# Altium project S3800.PrjPCB (part 1 of 3)
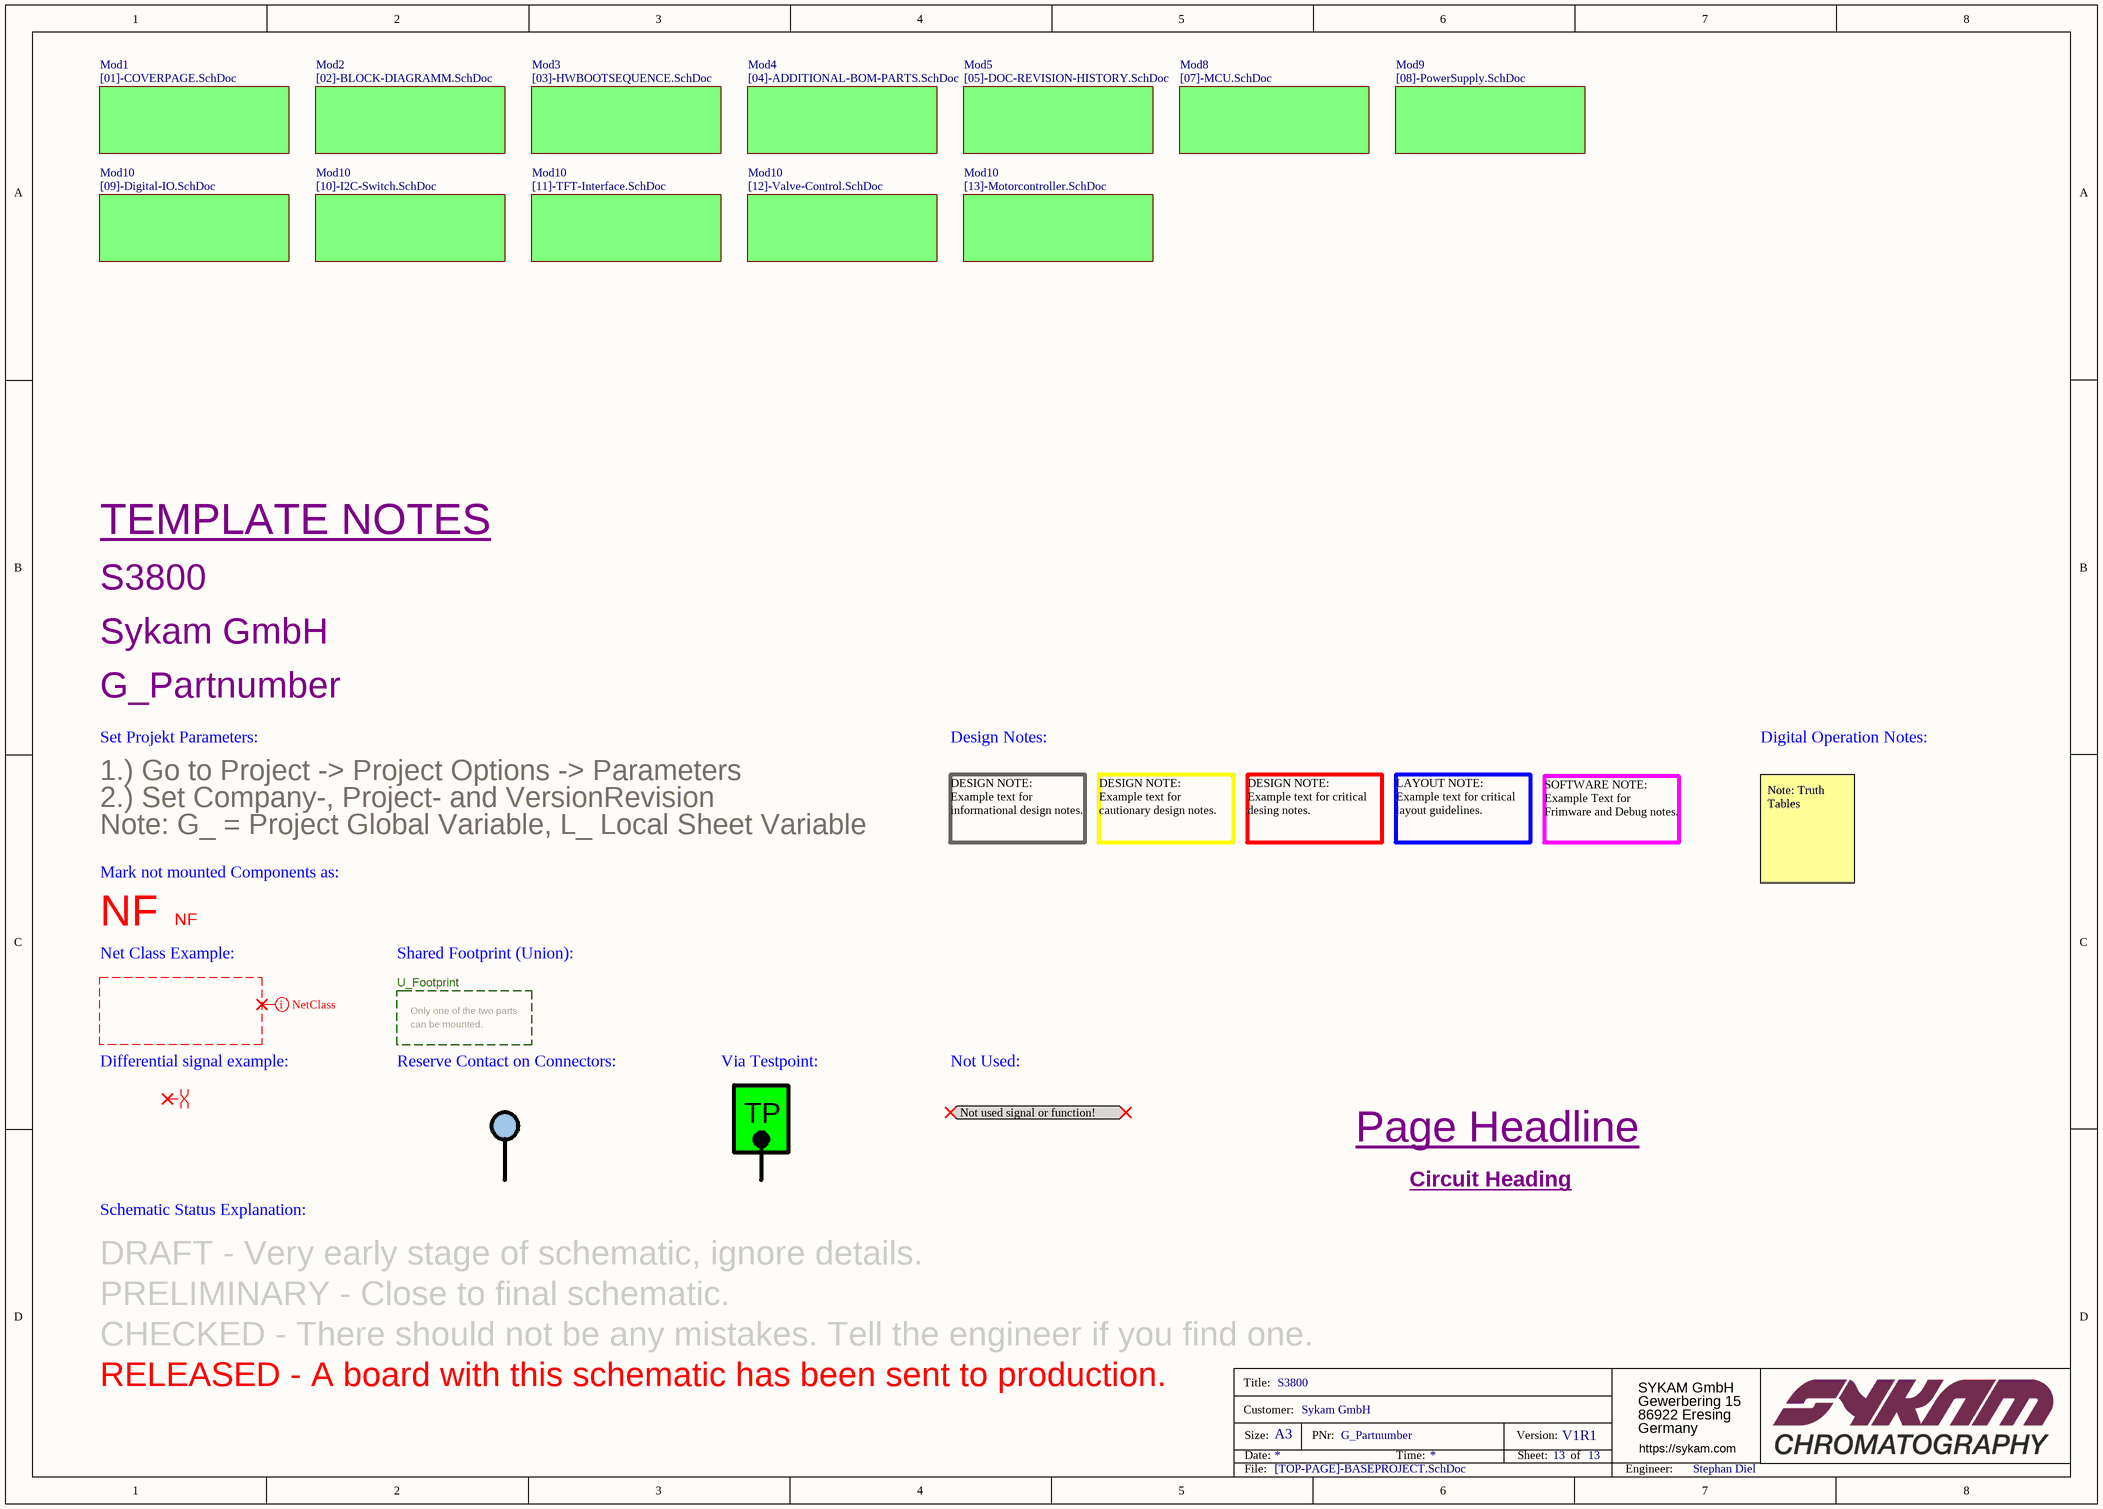
[diagram p0: [TOP-PAGE]-BASEPROJECT.SchDoc]
G_ADRESS_Street_NR: Gewerbering 15; G_Company-Name: SYKAM GmbH; G_Company-Page: https://sykam.com; G_Country: Germany; G_Customer_Name: Sykam GmbH; G_Developer: Stephan Diel; G_Firmware_Version: G_Firmware_Version; G_NF: NF; G_Partnumber: G_Partnumber; G_POSTCODE_PLZ_Town: 86922 Eresing; G_Project_Title: S3800; G_VersionNr: V1R1
13 sheets, 136 parts. Net scope: flat (ports and power ports of the same name join across sheets).
Board file: S3800.PcbDoc
Sheets:
  [TOP-PAGE]-BASEPROJECT.SchDoc
    Mod1 = [01]-COVERPAGE.SchDoc
    Mod2 = [02]-BLOCK-DIAGRAMM.SchDoc
    Mod3 = [03]-HWBOOTSEQUENCE.SchDoc
    Mod4 = [04]-ADDITIONAL-BOM-PARTS.SchDoc
    Mod5 = [05]-DOC-REVISION-HISTORY.SchDoc
    Mod8 = [07]-MCU.SchDoc
    Mod9 = [08]-PowerSupply.SchDoc
    Mod10 = [09]-Digital-IO.SchDoc
    Mod10 = [10]-I2C-Switch.SchDoc
    Mod10 = [11]-TFT-Interface.SchDoc
    Mod10 = [12]-Valve-Control.SchDoc
    Mod10 = [13]-Motorcontroller.SchDoc

## Sheet [TOP-PAGE]-BASEPROJECT.SchDoc: Cover Page
size A3; Ingenieur: Stephan Diel; Address1: Straße Nr x; Address2: xxxx Ort; Address3: Germany; Address4: www.xxxxx.de; DocumentNumber: 13; Revision: V1I1; SheetNumber: 13; SheetTotal: 13; NavArtikelnummern: xxxxx

### Sub-sheets
Mod1 = [01]-COVERPAGE.SchDoc: no entries
Mod2 = [02]-BLOCK-DIAGRAMM.SchDoc: no entries
Mod3 = [03]-HWBOOTSEQUENCE.SchDoc: no entries
Mod4 = [04]-ADDITIONAL-BOM-PARTS.SchDoc: no entries
Mod5 = [05]-DOC-REVISION-HISTORY.SchDoc: no entries
Mod8 = [07]-MCU.SchDoc: no entries
Mod9 = [08]-PowerSupply.SchDoc: no entries
Mod10 = [09]-Digital-IO.SchDoc: no entries
Mod10 = [10]-I2C-Switch.SchDoc: no entries
Mod10 = [11]-TFT-Interface.SchDoc: no entries
Mod10 = [12]-Valve-Control.SchDoc: no entries
Mod10 = [13]-Motorcontroller.SchDoc: no entries

### Ports
Not used signal or function! (bidir)

### Layout directives
mark named NetClass: (no net found under the mark)
differential pair: (no net found under the mark)

### Notes on the sheet
- TEMPLATE NOTES
- Set Projekt Parameters:
- 1.) Go to Project -> Project Options -> Parameters
- Design Notes:
- Digital Operation Notes:
- 2.) Set Company-, Project- and VersionRevision
- Note: G_ = Project Global Variable, L_ Local Sheet Variable
- DESIGN NOTE:
  Example text for informational design notes.
- DESIGN NOTE:
  Example text for cautionary design notes.
- DESIGN NOTE:
  Example text for critical desing notes.
- LAYOUT NOTE:
  Example text for critical layout guidelines.
- SOFTWARE NOTE:
  Example Text for Frimware and Debug notes.
- Mark not mounted Components as:
- Note: Truth Tables
- Net Class Example:
- U_Footprint
- Shared Footprint (Union):
- Only one of the two parts
- can be mounted.
- Differential signal example:
- Reserve Contact on Connectors:
- Via Testpoint:
- TP
- Not Used:
- Page Headline
- Circuit Heading
- Schematic Status Explanation:
- DRAFT - Very early stage of schematic, ignore details.
- PRELIMINARY - Close to final schematic.
- CHECKED - There should not be any mistakes. Tell the engineer if you find one.
- RELEASED - A board with this schematic has been sent to production.
- Title:
- Customer:
- Size:
- Date:
- A3
- PNr:
- Time:
- Version:
- Sheet:
- of
- File:
- Engineer:

## Sheet [01]-COVERPAGE.SchDoc: L_Projekt-Name
size A3; Ingenieur: Stephan Diel; Organization: Sykam GmbH; Address1: Gewerbering 15; Address2: 86922 Eresing; Address3: Germany; Address4: https://sykam.com; DocumentNumber: 1; SheetNumber: 1; SheetTotal: 13; Status: Release
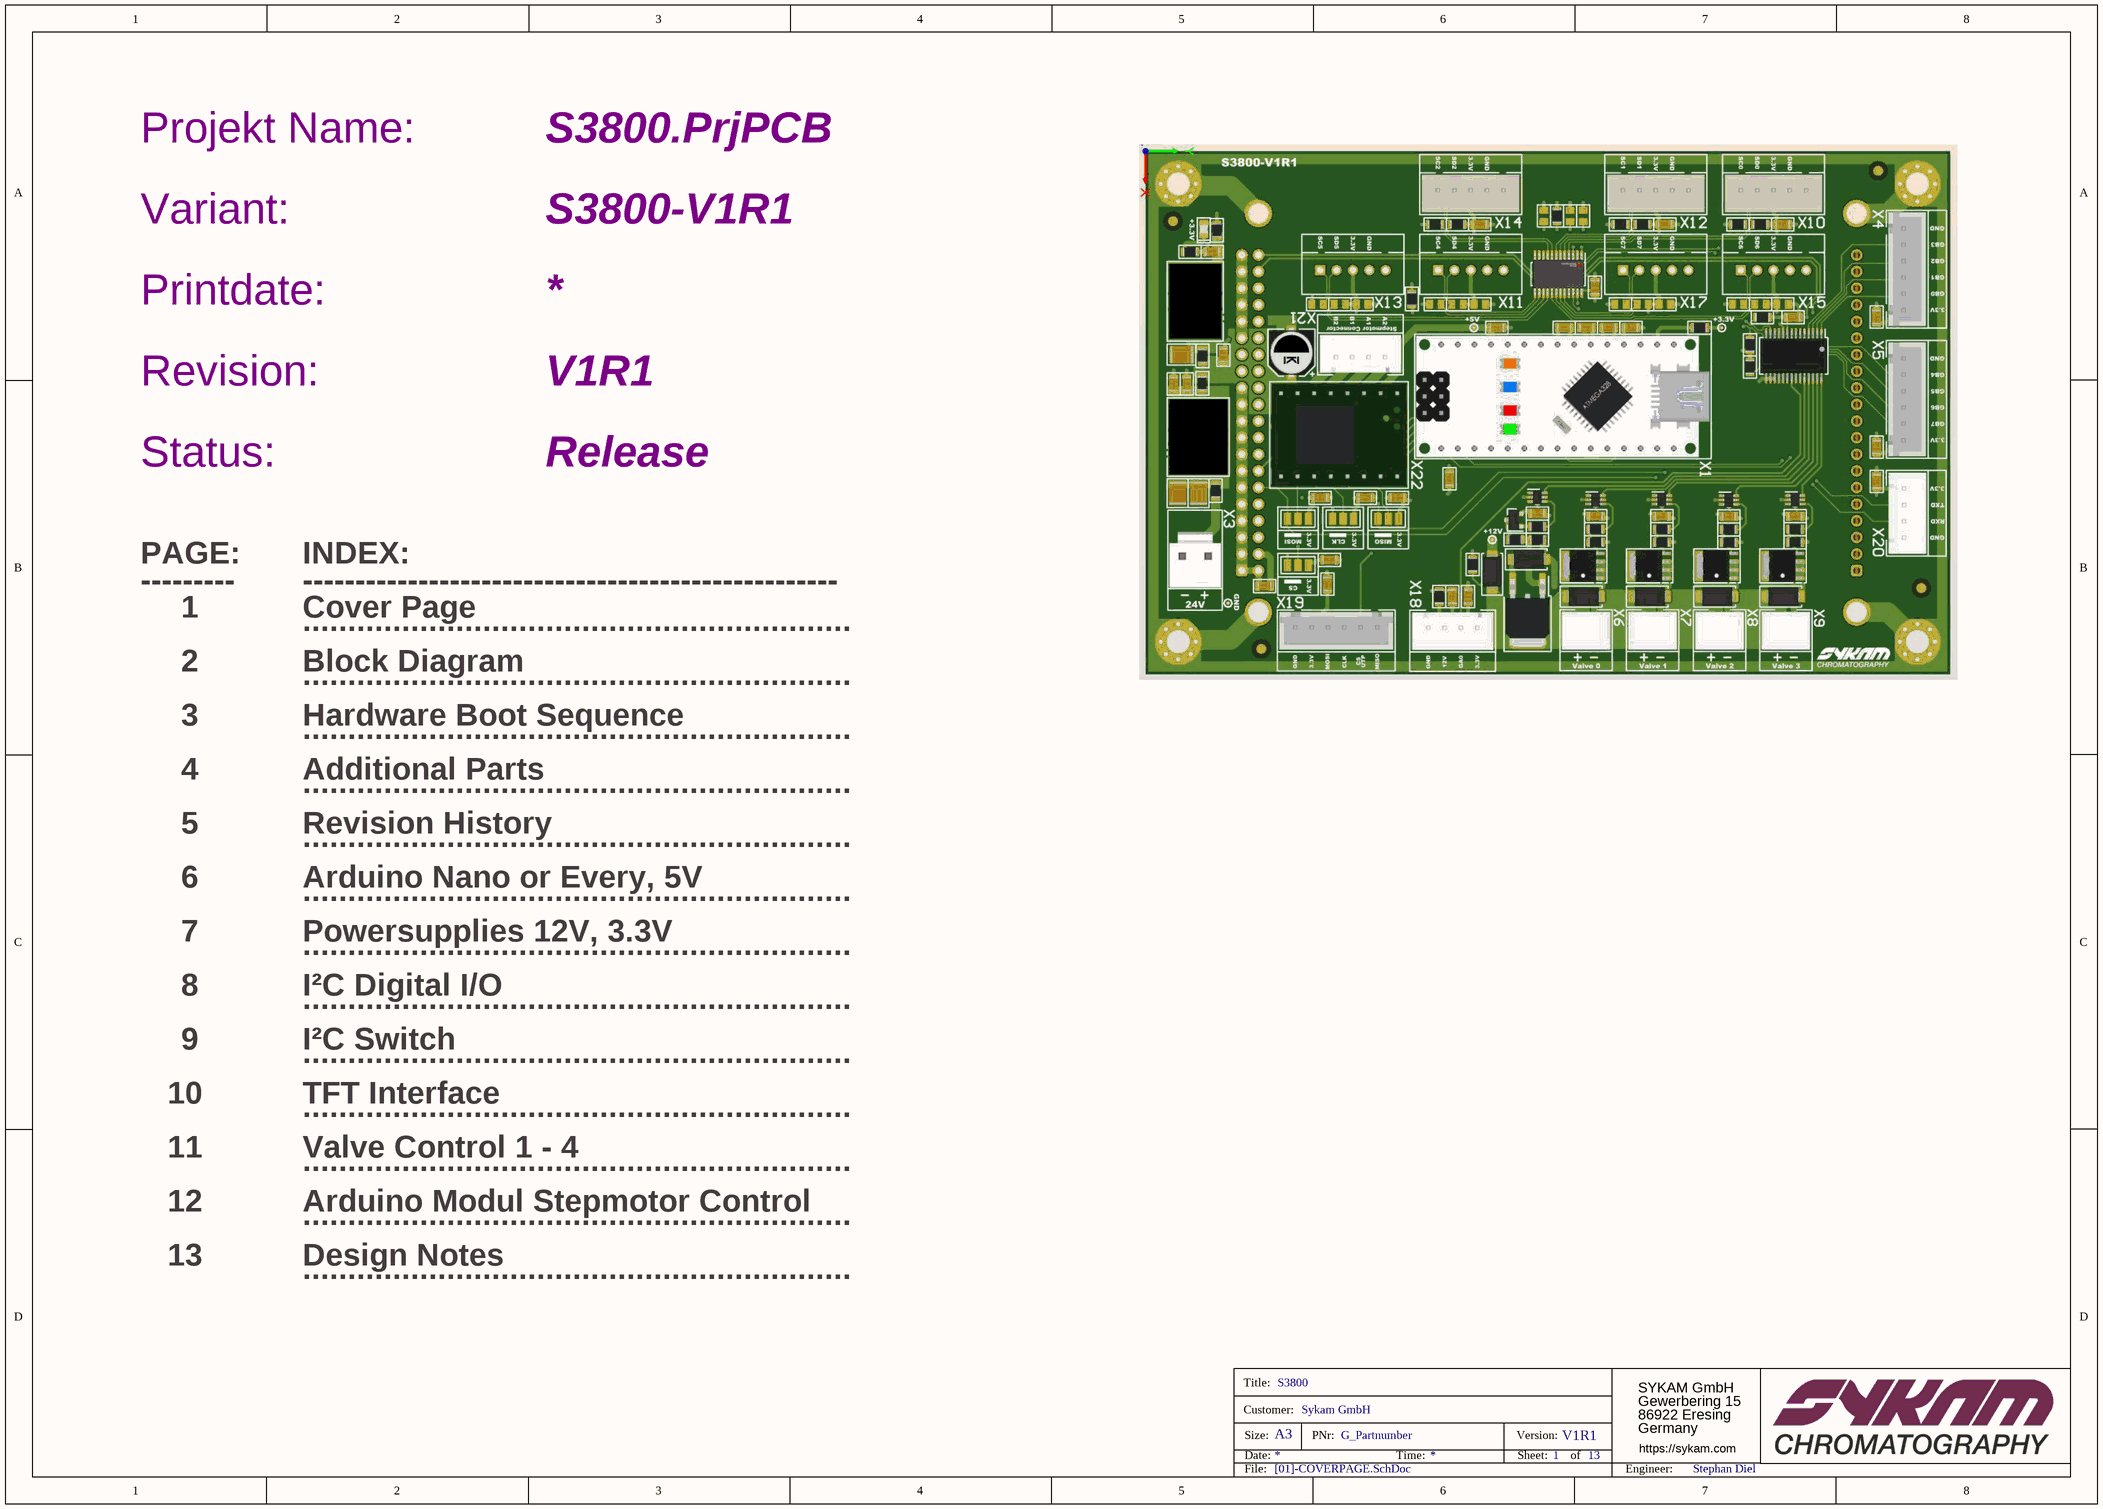
[diagram p1: [01]-COVERPAGE.SchDoc]

### Notes on the sheet
- Projekt Name:
- Variant:
- S3800-V1R1
- Printdate:
- Revision:
- Status:
- PAGE:
- INDEX:
- ---------
- 1
- ---------------------------------------------------
- .............................................................
- Cover Page
- 2
- Block Diagram
- 3
- 4
- Hardware Boot Sequence
- Additional Parts
- 5
- Revision History
- 6
- Arduino Nano or Every, 5V
- 7
- Powersupplies 12V, 3.3V
- 8
- 9
- I²C Digital I/O
- I²C Switch
- 10
- TFT Interface
- 11
- Valve Control 1 - 4
- 12
- Arduino Modul Stepmotor Control
- 13
- Design Notes
- Title:
- Customer:
- Size:
- Date:
- A3
- PNr:
- Time:
- Version:
- Sheet:
- of
- File:
- Engineer:

## Sheet [02]-BLOCK-DIAGRAMM.SchDoc: Blockdiagramm
size A3; Ingenieur: Stephan Diel; Organization: Sykam GmbH; Address1: Gewerbering 15; Address2: 86922 Eresing; Address3: Germany; Address4: https://sykam.com; DocumentNumber: 2; SheetNumber: 2; SheetTotal: 13
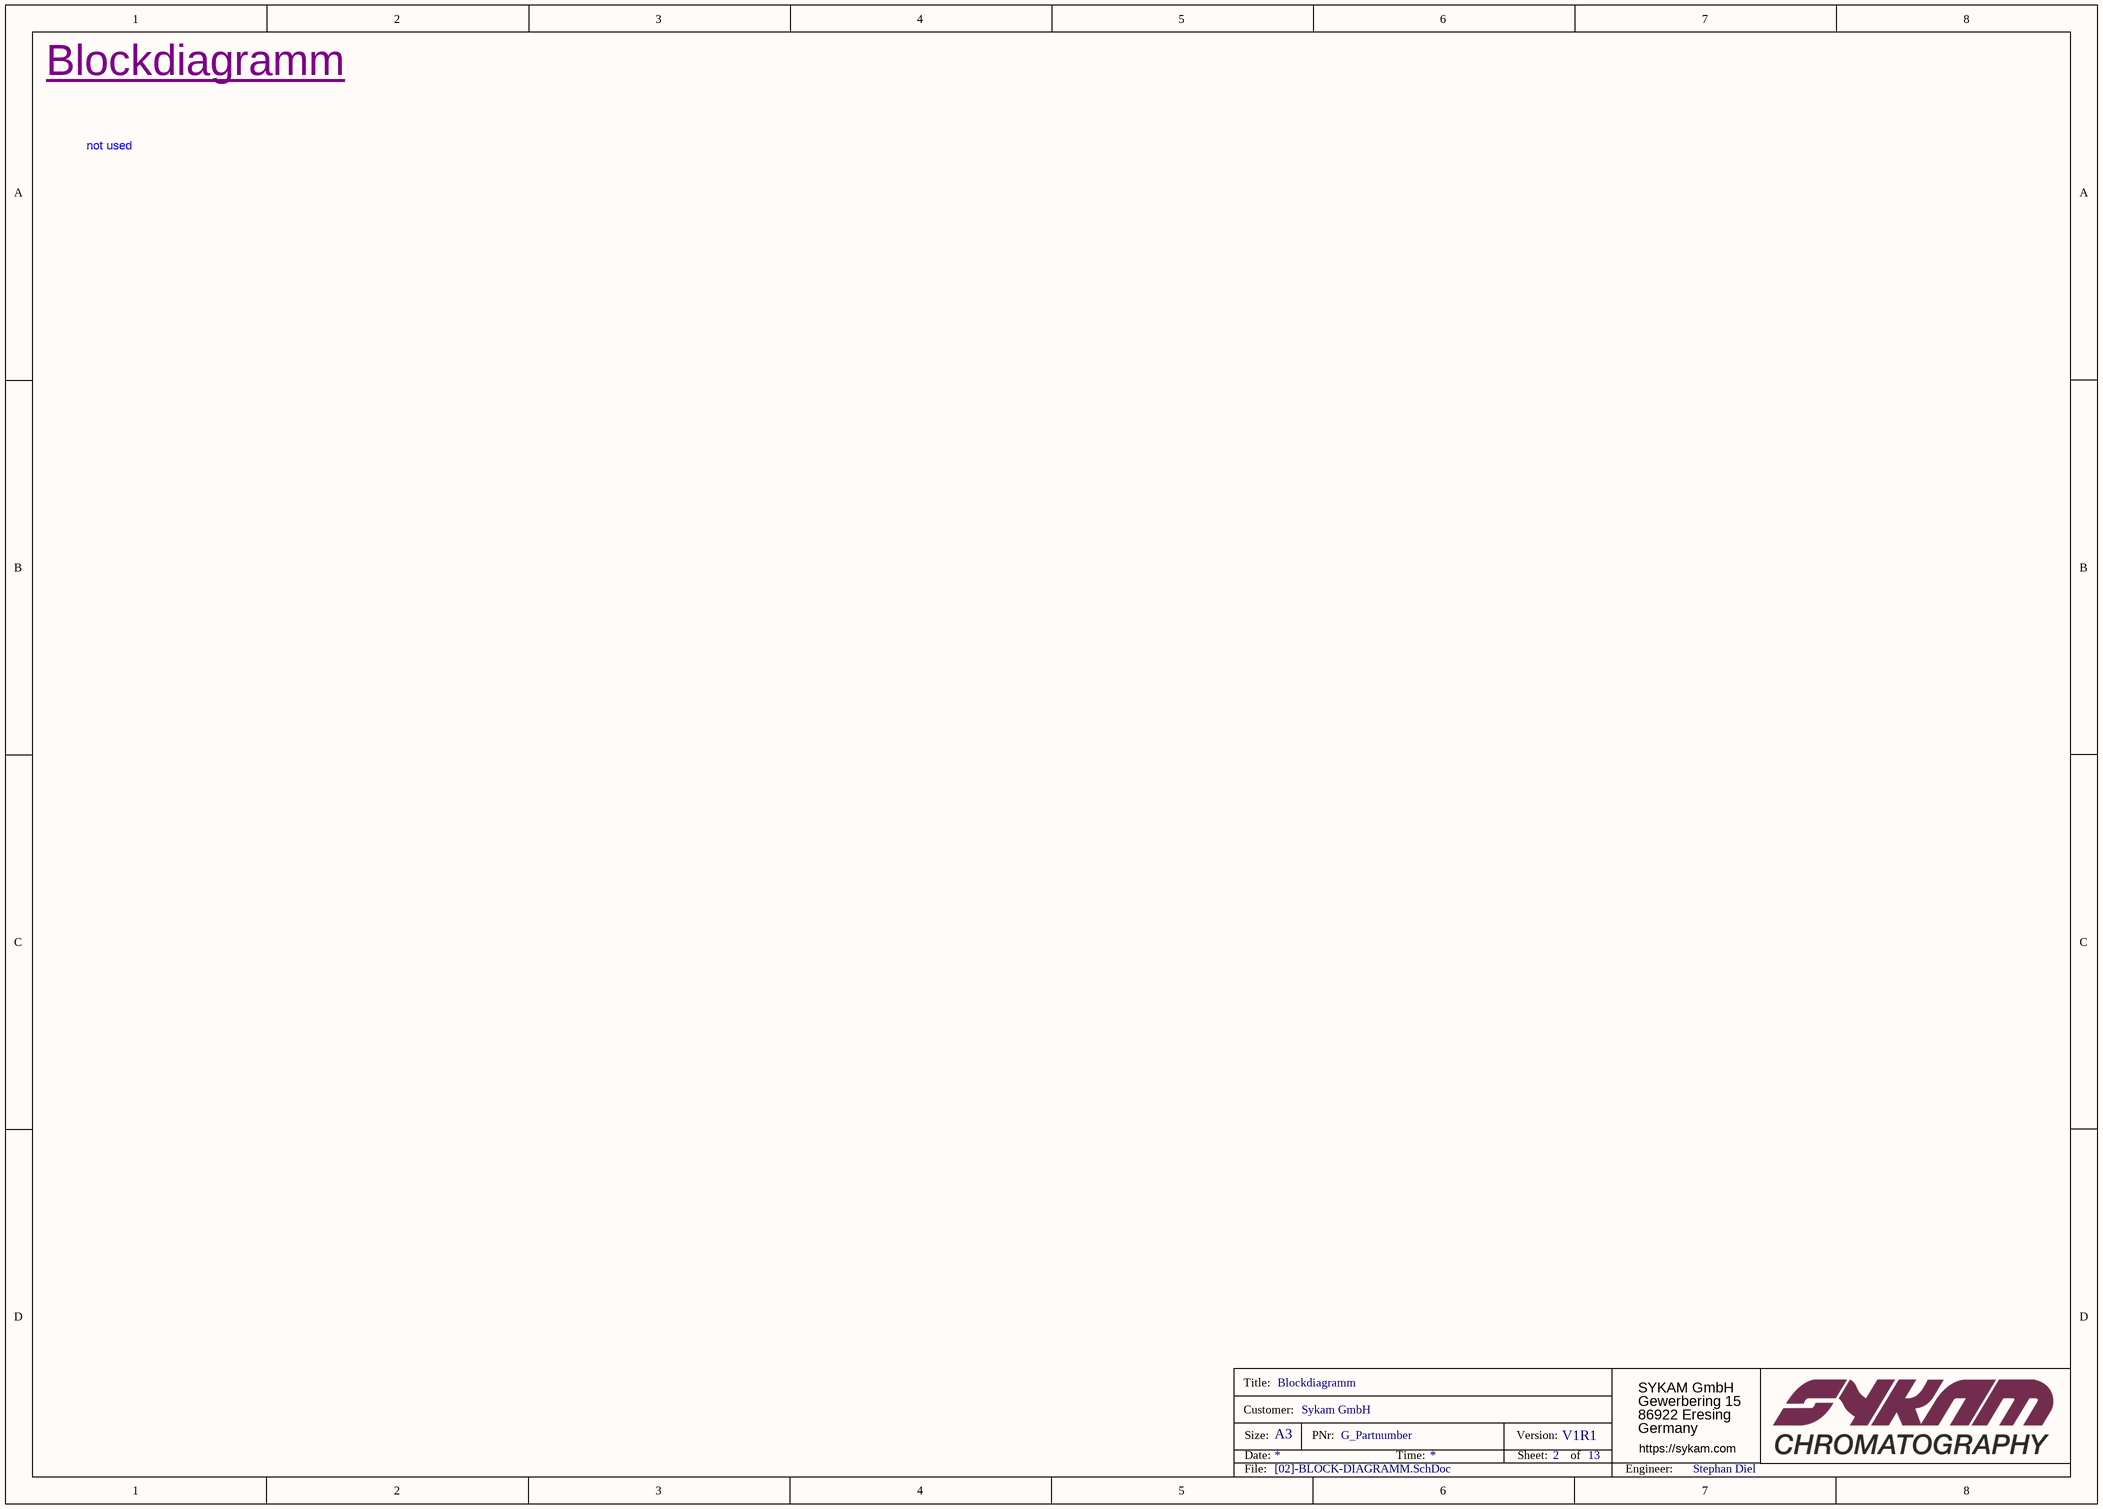
[diagram p2: [02]-BLOCK-DIAGRAMM.SchDoc]

### Notes on the sheet
- not used
- Title:
- Customer:
- Size:
- Date:
- A3
- PNr:
- Time:
- Version:
- Sheet:
- of
- File:
- Engineer:

## Sheet [03]-HWBOOTSEQUENCE.SchDoc: Hardware Boot Sequenz
size A3; DocumentNumber: 3; Revision: 2.0; SheetNumber: 3; SheetTotal: 13
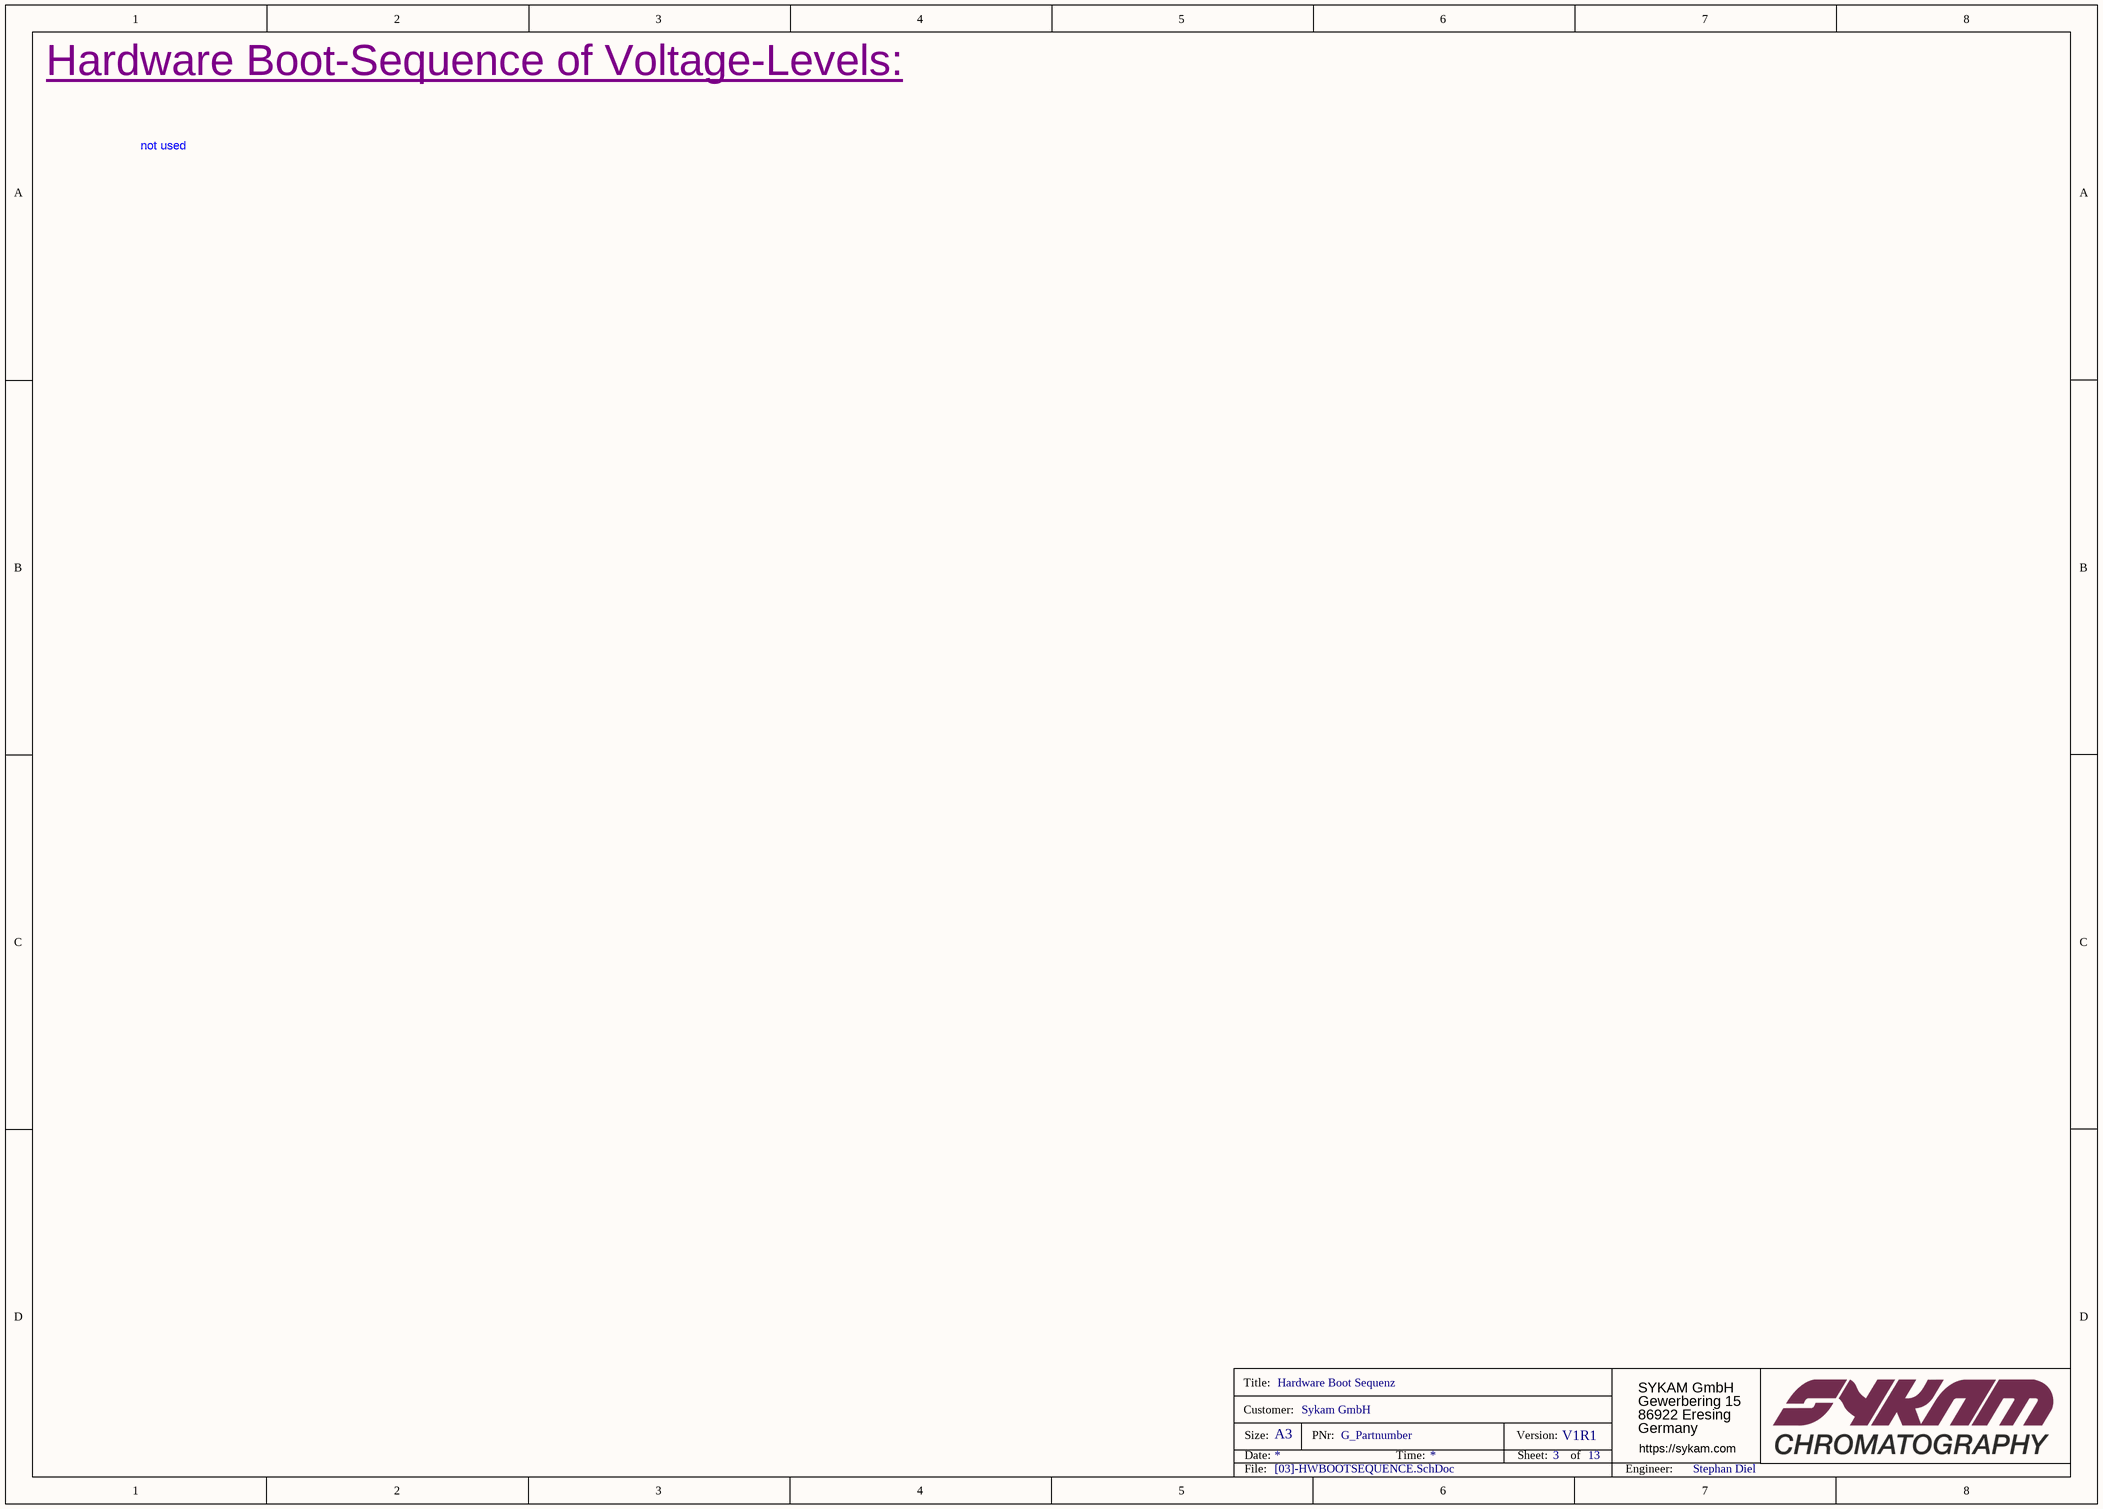
[diagram p3: [03]-HWBOOTSEQUENCE.SchDoc]

### Notes on the sheet
- Hardware Boot-Sequence of Voltage-Levels:
- not used
- Title:
- Customer:
- Size:
- Date:
- A3
- PNr:
- Time:
- Version:
- Sheet:
- of
- File:
- Engineer:

## Sheet [04]-ADDITIONAL-BOM-PARTS.SchDoc: Additional BOM Parts
size A3; Ingenieur: Stephan Diel; Organization: Dr. Hönle AG; Address1: Lochhamer Schlag 1; Address2: 82166 Gräfelfing; Address3: Germany; Address4: www.hoenle.de; DocumentNumber: 4; Revision: e01; SheetNumber: 4; SheetTotal: 13; NavArtikelnummern: KPL 08xxxxx LP 08xxxxx
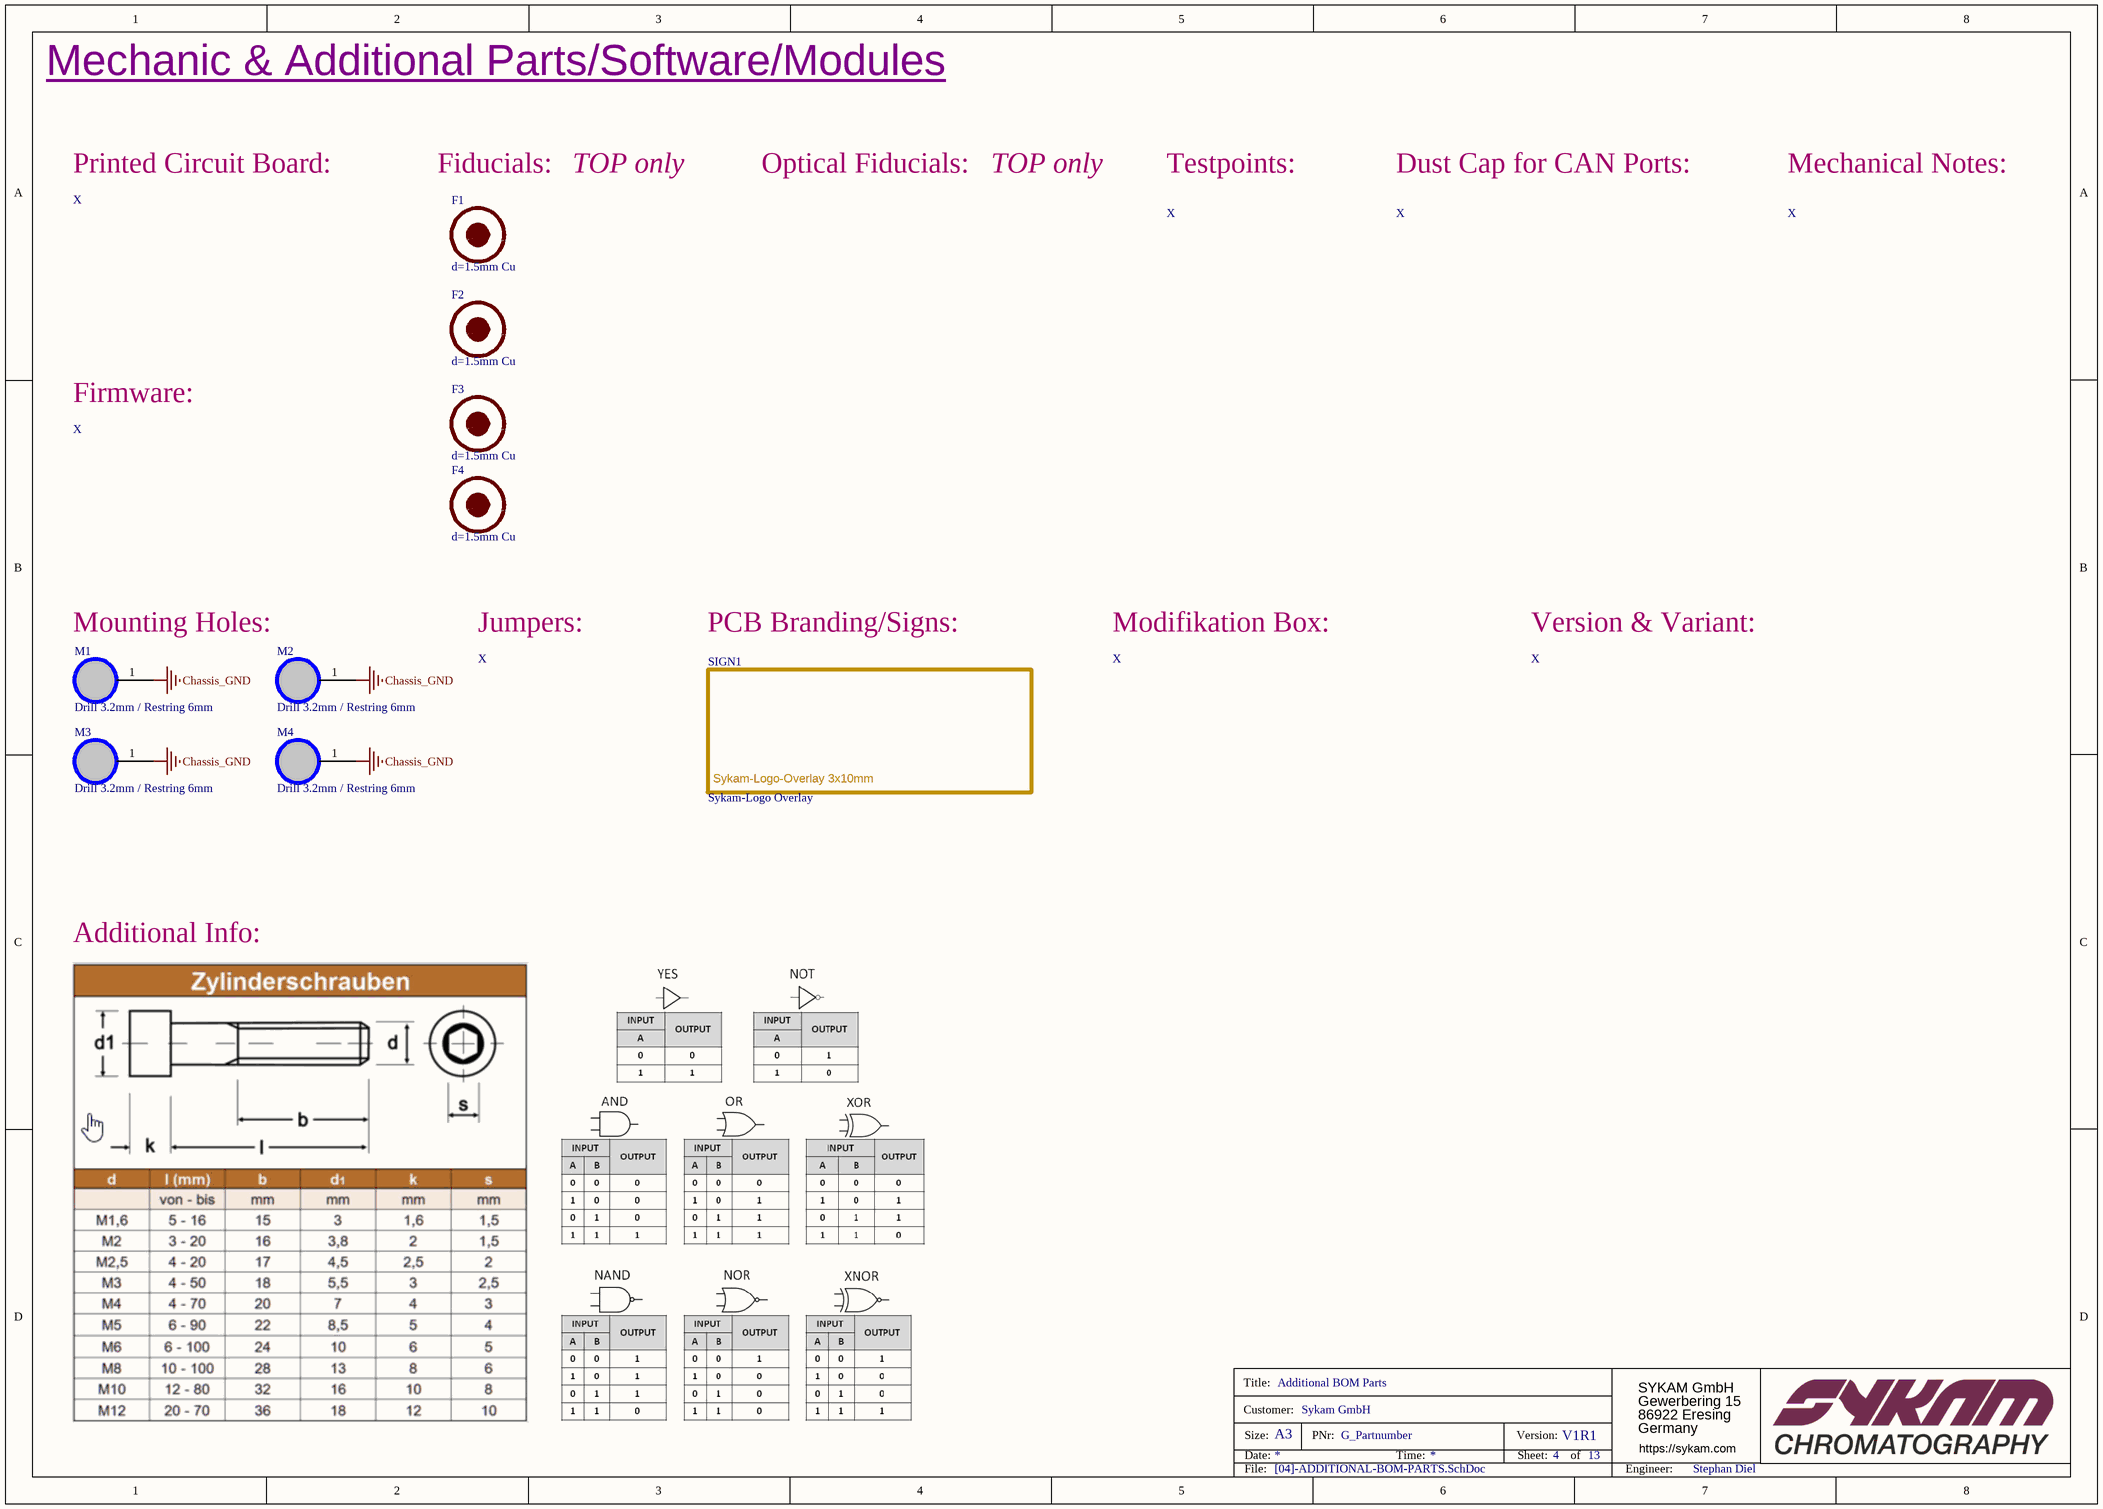
[diagram p4: [04]-ADDITIONAL-BOM-PARTS.SchDoc]

### Parts
F1  d=1.5mm Cu  [Fiducial_1]  (no BOM)
F2  d=1.5mm Cu  [Fiducial_1]  (no BOM)
F3  d=1.5mm Cu  [Fiducial_1]  (no BOM)
F4  d=1.5mm Cu  [Fiducial_1]  (no BOM)
M1  Drill 3.2mm / Restring 6mm  [Mountingholes_M3_ZylKS_Plated]  (no BOM)
M2  Drill 3.2mm / Restring 6mm  [Mountingholes_M3_ZylKS_Plated]  (no BOM)
M3  Drill 3.2mm / Restring 6mm  [Mountingholes_M3_ZylKS_Plated]  (no BOM)
M4  Drill 3.2mm / Restring 6mm  [Mountingholes_M3_ZylKS_Plated]  (no BOM)
SIGN1  Sykam-Logo Overlay  [Logo-Sykam_3x10mm]  (no BOM)

### Nets
Chassis_GND: M1.1 M2.1 M3.1 M4.1

### Notes on the sheet
- Mechanic & Additional Parts/Software/Modules
- Printed Circuit Board:
- Fiducials:
- TOP only
- Optical Fiducials:
- Testpoints:
- Dust Cap for CAN Ports:
- Mechanical Notes:
- X
- Firmware:
- Mounting Holes:
- Jumpers:
- PCB Branding/Signs:
- Modifikation Box:
- Version & Variant:
- Additional Info:
- Title:
- Customer:
- Size:
- Date:
- A3
- PNr:
- Time:
- Version:
- Sheet:
- of
- File:
- Engineer:
- (in symbol Logo-3x10mm) Sykam-Logo-Overlay 3x10mm

### Library data of the parts
F1-F4 = Fiducial_1,5mm: Fiducial Passermarke mit 1.5mm Druchmesser.
M1-M4 = Mountinghole_M3
SIGN1 = Logo-3x10mm: Sykam Logo im Overlay

## Sheet [05]-DOC-REVISION-HISTORY.SchDoc: Stackup & Calculations:
size A3; Ingenieur: Stephan Diel; Organization: Dr. Hönle AG; Address1: Lochhamer Schlag 1; Address2: 82166 Gräfelfing; Address3: Germany; Address4: www.hoenle.de; DocumentNumber: 5; Revision: e01; SheetNumber: 5; SheetTotal: 13
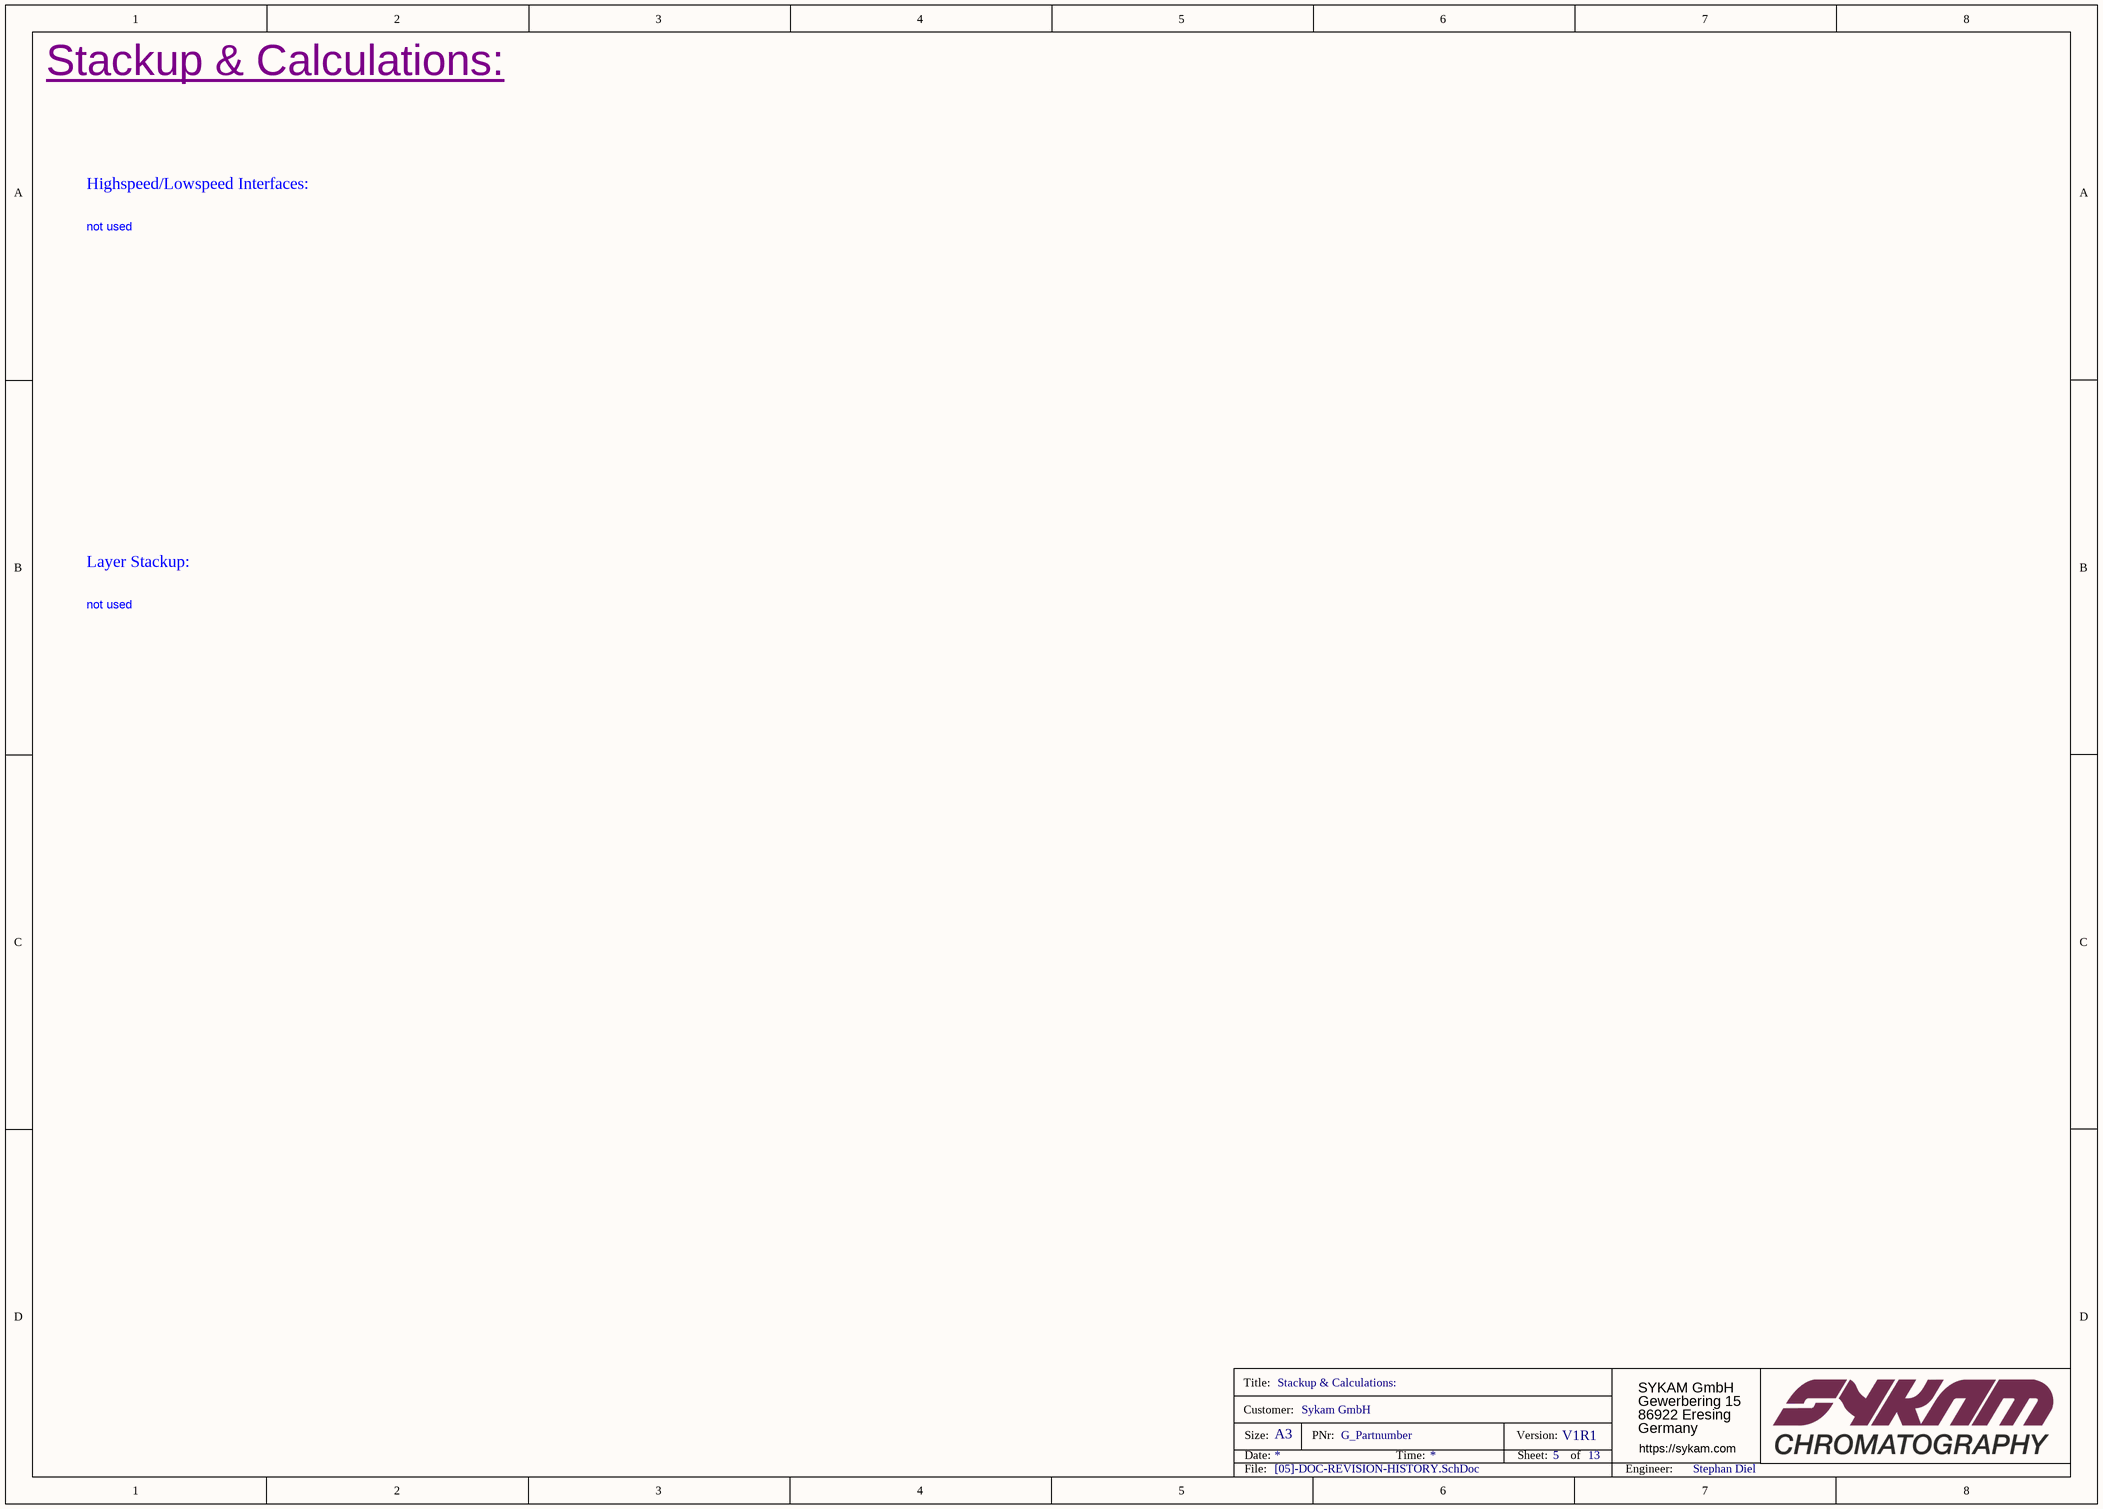
[diagram p5: [05]-DOC-REVISION-HISTORY.SchDoc]

### Notes on the sheet
- Stackup & Calculations:
- Highspeed/Lowspeed Interfaces:
- not used
- Layer Stackup:
- Title:
- Customer:
- Size:
- Date:
- A3
- PNr:
- Time:
- Version:
- Sheet:
- of
- File:
- Engineer:

## Sheet [07]-MCU.SchDoc: MCU
size A3; Organization: Toradex AG; Address1: Altsagenstrasse 5; Address2: Horw; Address3: 6048; Address4: Switzerland; DocumentNumber: 6; Revision: V3.2; SheetNumber: 6; SheetTotal: 13; PageSetup: Record=PageOptions|CenterHorizontal=True|CenterVertical=True|PrintScale=0.73|XCorrection=1.00|YCorrection=1.00|PrintKind=0|BorderSize=5000000|LeftOffset=0|BottomOffset=0|Orientation=2|PaperLength=1000|PaperWidth=1000|Scale=100|PaperSource=7|PrintQuality=600|MediaType=1|DitherType=10|PaperKind=A4|PrintScaleMode=1
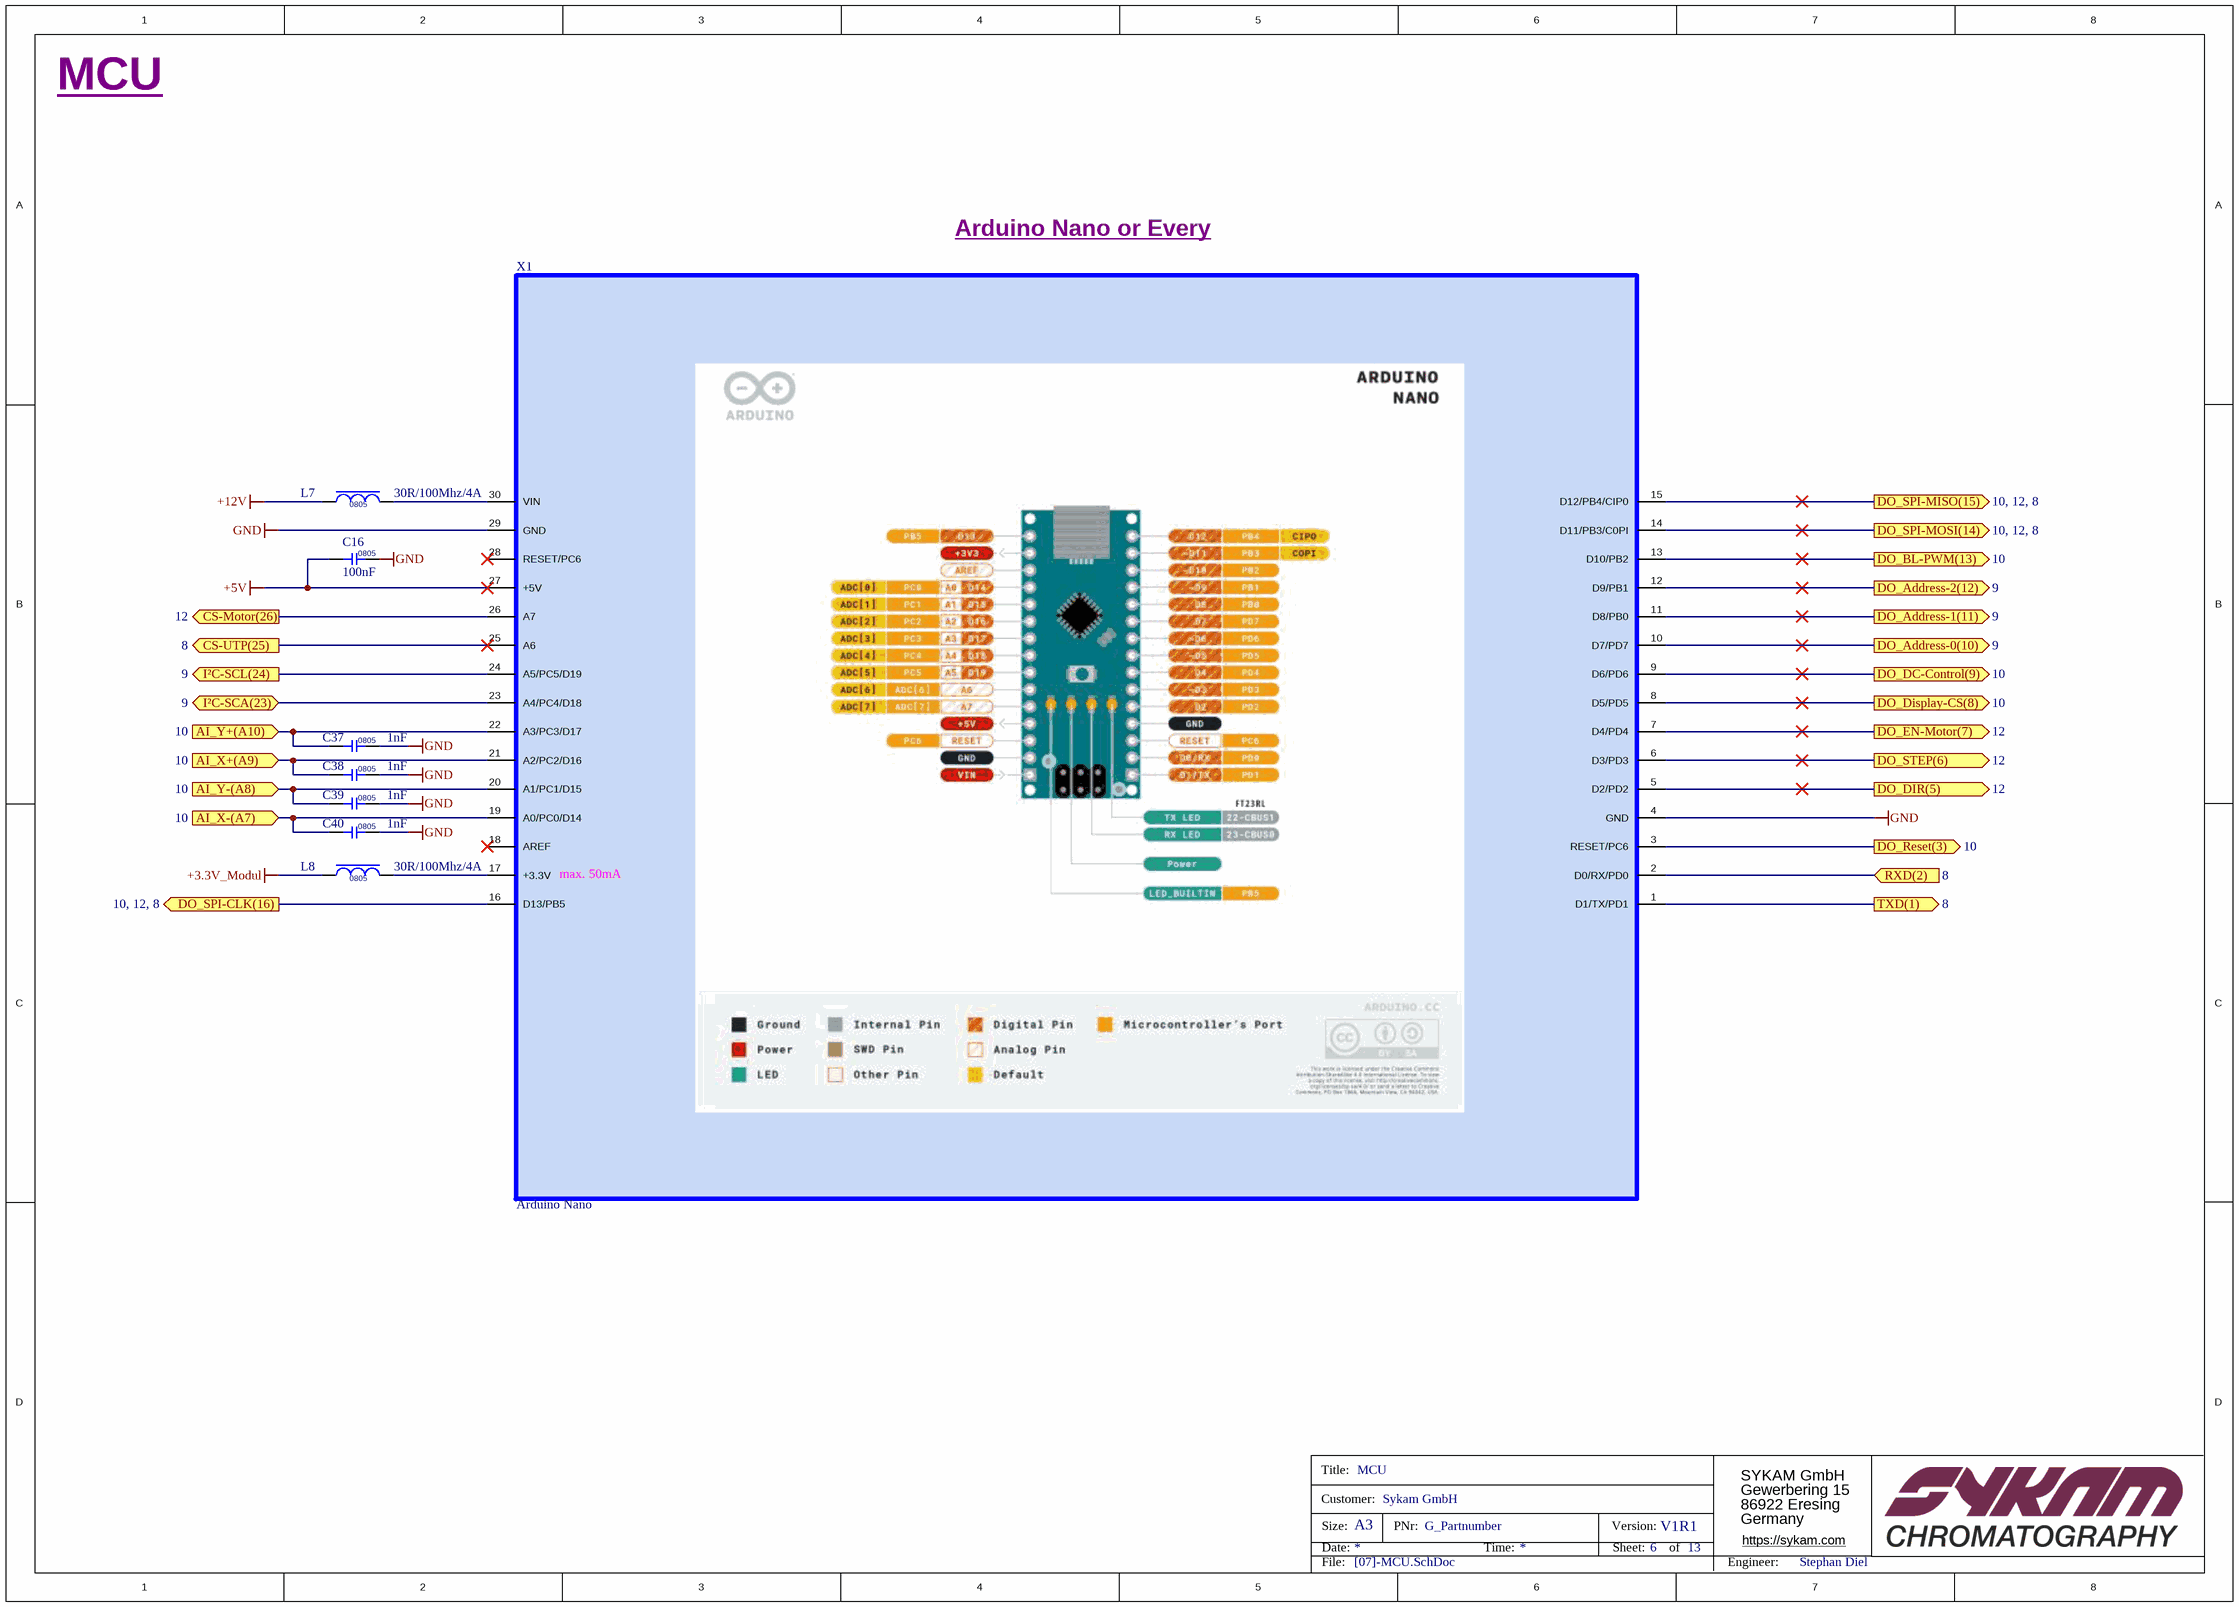
[diagram p6: [07]-MCU.SchDoc]

### Parts
C16  100nF  [C0805]
C37  1nF  [C0805]
C38  1nF  [C0805]
C39  1nF  [C0805]
C40  1nF  [C0805]
L7  30R/100Mhz/4A  [L0805]
L8  30R/100Mhz/4A  [L0805]
X1  Arduino Nano  [Arduino-Nano-Connectors]

### Ports
AI_X+(A9) (in, see 10), AI_X-(A7) (in, see 10), AI_Y+(A10) (in, see 10), AI_Y-(A8) (in, see 10), CS-Motor(26) (out, see 12), CS-UTP(25) (out, see 8), DO_Address-0(10) (out, see 9), DO_Address-1(11) (out, see 9), DO_Address-2(12) (out, see 9), DO_BL-PWM(13) (out, see 10), DO_DC-Control(9) (out, see 10), DO_DIR(5) (out, see 12), DO_Display-CS(8) (out, see 10), DO_EN-Motor(7) (out, see 12), DO_Reset(3) (out, see 10), DO_SPI-CLK(16) (out, see 10, 12, 8), DO_SPI-MISO(15) (out, see 10, 12, 8), DO_SPI-MOSI(14) (out, see 10, 12, 8), DO_STEP(6) (out, see 12), I²C-SCA(23) (bidir, see 9), I²C-SCL(24) (out, see 9), RXD(2) (in, see 8), TXD(1) (out, see 8)

### Nets
+3.3V_Modul: L8.1
+5V: C16.1 X1.27(+5V)
+12V: L7.1
GND: C16.2 C37.2 C38.2 C39.2 C40.2 X1.4(GND) X1.29(GND)
CLK: X1.16(D13/PB5) ; port DO_SPI-CLK(16)
CS: X1.8(D5/PD5) ; port DO_Display-CS(8)
D/C: X1.9(D6/PD6) ; port DO_DC-Control(9)
Lite: X1.13(D10/PB2) ; port DO_BL-PWM(13)
M_DIR: X1.5(D2/PD2) ; port DO_DIR(5)
M_EN: X1.7(D4/PD4) ; port DO_EN-Motor(7)
M_STEP: X1.6(D3/PD3) ; port DO_STEP(6)
MISO: X1.15(D12/PB4/CIP0) ; port DO_SPI-MISO(15)
MOSI: X1.14(D11/PB3/C0PI) ; port DO_SPI-MOSI(14)
RST: X1.3(RESET/PC6) ; port DO_Reset(3)
X+: C38.1 X1.21(A2/PC2/D16) ; port AI_X+(A9)
X-: C40.1 X1.19(A0/PC0/D14) ; port AI_X-(A7)
Y+: C37.1 X1.22(A3/PC3/D17) ; port AI_Y+(A10)
Y-: C39.1 X1.20(A1/PC1/D15) ; port AI_Y-(A8)
NetIC2_1: X1.10(D7/PD7) ; port DO_Address-0(10)
NetIC2_2: X1.11(D8/PB0) ; port DO_Address-1(11)
NetIC2_21: X1.12(D9/PB1) ; port DO_Address-2(12)
NetIC2_22: X1.24(A5/PC5/D19) ; port I²C-SCL(24)
NetIC2_23: X1.23(A4/PC4/D18) ; port I²C-SCA(23)
NetJ1_1: X1.26(A7) ; port CS-Motor(26)
NetL7_2: L7.2 X1.30(VIN)
NetL8_2: L8.2 X1.17(+3.3V)
NetX1_1: X1.1(D1/TX/PD1) ; port TXD(1)
NetX1_2: X1.2(D0/RX/PD0) ; port RXD(2)
NetX1_25: X1.25(A6) ; port CS-UTP(25)

Not connected (* = marked no-connect by the designer): X1 18(AREF)* 28(RESET/PC6)*

### Notes on the sheet
- Arduino Nano or Every
- (near X1) max. 50mA
- Title:
- Customer:
- Size:
- Date:
- A3
- PNr:
- Time:
- Version:
- Sheet:
- of
- File:
- Engineer:
- Title
- Number:
- Revision:
- Sheet

### Library data of the parts
C16 = C_100nF_CC0805KRX7R9BB104: CAP CER 0.1UF 50V X7R 0805; Manufacturer: Yageo; Material: Ceramic; Tolerance: 10%; Insulation Resistance: 100GR; PCBChecked: initials after Checked; Supplier 1: Digi-Key; Manufacturer Part Number: CC0805KRX7R9BB104; RoHS: Yes; Category: Ceramic Capacitors; Mount: Surface Mount; Case/Package: 0805; Number of Pins: 2; Case Code (Metric): 2012; Case Code (Imperial): 0805; Min Operating Temperature: -55°C; Max Operating Temperature: 125°C; Packaging: Tape and Reel; Capacitance: 100nF; Voltage Rating: 50V; Package Quantity: 1; Dielectric: X7R; Termination: SMD/SMT; Voltage: 50V; Length: 2mm; Height: 0.85mm; Width: 0.049inch; Thickness: 0.033inch; Depth: 1.25mm; Radiation Hardening: No; REACH SVHC: No SVHC; Lead Free: Lead Free; Halogen Free: Halogen Free; ComponentLink1URL: https://datasheet.ciiva.com/11786/0900766b80d84f1d-11786009.pdf?src-supplier=RSComponents; ComponentLink1Description: https://datasheet.ciiva.com/11786/0900766b80d84f1d-11786009.pdf?src-supplier=RSComponents; ComponentLink2URL: https://datasheet.ciiva.com/11464/upy-gphc-x7r-6-3v-to-50v-8-11464757.pdf?src-supplier=Avnet; ComponentLink2Description: https://datasheet.ciiva.com/11464/upy-gphc-x7r-6-3v-to-50v-8-11464757.pdf?src-supplier=Avnet; ComponentLink3URL: https://datasheet.ciiva.com/28450/1489800-28450805.pdf?src-supplier=Element14; ComponentLink3Description: https://datasheet.ciiva.com/28450/1489800-28450805.pdf?src-supplier=Element14; ComponentLink4URL: https://datasheet.ciiva.com/155/mlccorderingcode-155929.pdf?src-supplier=Digi-Key; ComponentLink4Description: https://datasheet.ciiva.com/155/mlccorderingcode-155929.pdf?src-supplier=Digi-Key; ComponentLink5URL: https://datasheet.ciiva.com/155/mlccorderingcode-155930.pdf?src-supplier=Digi-Key; ComponentLink5Description: https://datasheet.ciiva.com/155/mlccorderingcode-155930.pdf?src-supplier=Digi-Key; ComponentLink6URL: https://datasheet.ciiva.com/155/mlccorderingcode-155931.pdf?src-supplier=Digi-Key; ComponentLink6Description: https://datasheet.ciiva.com/155/mlccorderingcode-155931.pdf?src-supplier=Digi-Key; ComponentLink7URL: https://datasheet.ciiva.com/46393/1734573-46393307.pdf?src-supplier=Element14; ComponentLink7Description: https://datasheet.ciiva.com/46393/1734573-46393307.pdf?src-supplier=Element14; ComponentLink8URL: https://datasheet.ciiva.com/16625/upy-gphc-x7r-6-3v-to-50v-8-16625549.pdf?src-supplier=Avnet+Europe; ComponentLink8Description: https://datasheet.ciiva.com/16625/upy-gphc-x7r-6-3v-to-50v-8-16625549.pdf?src-supplier=Avnet+Europe; ComponentLink9URL: https://datasheet.ciiva.com/29242/445210-da-01-en-kerko-chip-0805-x7r-0-1uf-10proz-50vg-29242074.pdf?src-supplier=Conrad; ComponentLink9Description: https://datasheet.ciiva.com/29242/445210-da-01-en-kerko-chip-0805-x7r-0-1uf-10proz-50vg-29242074.pdf?src-supplier=Conrad; Supplier Part Number 1: 311-1140-6-ND; Stock 1: 7118979; IPC7352C: done; SCHChecked: Initials after checked
C37-C40 = C_1nF_C0805C102K5RAC7411: Multilayer Ceramic Capacitors MLCC - SMD/SMT 50volts 1000pF X7R 10%; Manufacturer: KEMET; Voltage Rating: 50V; Manufacturer Part Number: C0805C102K5RAC7411; RoHS: Yes; Category: Ceramic Capacitors; Stock 1: 30000; Pricing 1: 15000=0,01862, 30000=0,01764 (USD); Mount: Surface Mount; Case/Package: 0805; Case Code (Metric): 2012; Case Code (Imperial): 0805; Dielectric Material: Ceramic; Min Operating Temperature: -55°C; Max Operating Temperature: 125°C; Termination: SMD/SMT; Capacitance: 1nF; Package Quantity: 15000; Voltage Rating (DC): 50V; Tolerance: 10%; Packaging: Tape and Reel; Dielectric: X7R; Length: 0.079inch; Height: 0.78mm; Thickness: 0.035inch; Width: 0.049inch; ComponentLink1URL: http://components.arrow.com/part/dataview/0323_00324664?src-supplier=Arrow+Europe; ComponentLink1Description: http://components.arrow.com/part/dataview/0323_00324664?src-supplier=Arrow+Europe; ComponentLink2URL: http://www.mouser.com/ds/2/212/KEM_C1002_X7R_SMD-1102033.pdf?src-supplier=Mouser; ComponentLink2Description: http://www.mouser.com/ds/2/212/KEM_C1002_X7R_SMD-1102033.pdf?src-supplier=Mouser; ComponentLink3URL: https://api.kemet.com/component-edge/download/datasheet/C0805C102K5RAC7411.pdf?src-supplier=Digi-Key; ComponentLink3Description: https://api.kemet.com/component-edge/download/datasheet/C0805C102K5RAC7411.pdf?src-supplier=Digi-Key; Supplier 1: Digi-Key; Supplier Part Number 1: 311-1127-1-ND
L7 L8 = L_BLM21PG300SN1D: Ferrite Beads Multi-Layer 30Ohm 100MHz 4A 14mOhm DCR 0805 T/R; Manufacturer: Murata; Material: Steel,Ferrite; Resistance: 15mR; Tolerance: 25%; Impedance: 30R; Shielding: Unshielded; Number of Circuits: 1; DC Resistance (DCR): 14mR; Max DC Current: 3A; PCBChecked: initials after Checked; Supplier 1: Digi-Key; Manufacturer Part Number: BLM21PG300SN1D; RoHS: Yes; Category: Ferrite Beads and Chips; Case/Package: 0805; Number of Pins: 2; Core Material: Ferrite; Case Code (Metric): 2012; Case Code (Imperial): 0805; Min Operating Temperature: -55°C; Max Operating Temperature: 125°C; Frequency: 100MHz; Packaging: Tape and Reel; Package Quantity: 1; Max Current Rating: 4A; Number of Lines: 1; Termination: SMD/SMT; Test Frequency: 100MHz; DC Current: 3A; Military Standard: Not; Current Rating: 4A; Length: 2mm; Height: 0.85mm; Width: 1.25mm; Depth: 1.25mm; Radiation Hardening: No; Lead Free: Lead Free; REACH SVHC: No SVHC; ComponentLink1URL: https://datasheet.ciiva.com/11795/0900766b80021a8e-11795584.pdf?src-supplier=RSComponents; ComponentLink1Description: https://datasheet.ciiva.com/11795/0900766b80021a8e-11795584.pdf?src-supplier=RSComponents; ComponentLink2URL: https://datasheet.ciiva.com/19460/1845339-19460237.pdf?src-supplier=Jameco; ComponentLink2Description: https://datasheet.ciiva.com/19460/1845339-19460237.pdf?src-supplier=Jameco; ComponentLink3URL: https://datasheet.ciiva.com/25903/l0110s0100blm21p-25903510.pdf?src-supplier=Avnet+Europe; ComponentLink3Description: https://datasheet.ciiva.com/25903/l0110s0100blm21p-25903510.pdf?src-supplier=Avnet+Europe; ComponentLink4URL: https://datasheet.ciiva.com/3081/l0110s0100blm21p-3081657.pdf?src-supplier=Avnet; ComponentLink4Description: https://datasheet.ciiva.com/3081/l0110s0100blm21p-3081657.pdf?src-supplier=Avnet; ComponentLink5URL: https://datasheet.ciiva.com/16199/l0110s0100blm21p-16199625.pdf?src-supplier=Future+Electronics; ComponentLink5Description: https://datasheet.ciiva.com/16199/l0110s0100blm21p-16199625.pdf?src-supplier=Future+Electronics; ComponentLink6URL: https://datasheet.ciiva.com/3081/l0110s0100blm21p-3081658.pdf?src-supplier=Avnet; ComponentLink6Description: https://datasheet.ciiva.com/3081/l0110s0100blm21p-3081658.pdf?src-supplier=Avnet; ComponentLink7URL: https://datasheet.ciiva.com/6212/l0110s0100blm21p-6212358.pdf?src-supplier=Digi-Key; ComponentLink7Description: https://datasheet.ciiva.com/6212/l0110s0100blm21p-6212358.pdf?src-supplier=Digi-Key; ComponentLink8URL: https://datasheet.ciiva.com/6212/l0110s0100blm21p-6212360.pdf?src-supplier=Digi-Key; ComponentLink8Description: https://datasheet.ciiva.com/6212/l0110s0100blm21p-6212360.pdf?src-supplier=Digi-Key; ComponentLink9URL: https://datasheet.ciiva.com/8021/1756152-8021599.pdf?src-supplier=Element14; ComponentLink9Description: https://datasheet.ciiva.com/8021/1756152-8021599.pdf?src-supplier=Element14; ComponentLink10URL: https://datasheet.ciiva.com/41449/001172365-da-01-en-drossel-0805-30r0-2-0x1-25mm-4000st-41449606.pdf?src-supplier=Conrad; ComponentLink10Description: https://datasheet.ciiva.com/41449/001172365-da-01-en-drossel-0805-30r0-2-0x1-25mm-4000st-41449606.pdf?src-supplier=Conrad; Supplier Part Number 1: 490-1052-1-ND; Stock 1: 88452; IPC7352C: done; SCHChecked: Initials after checked
X1 = CON_Modul_ArduinoNano3: ATmega328 Microcontroller Development Board 16MHz CPU 2KB RAM 1KB/32KB EEPROM/Flash; Manufacturer Part Number: A000005; Operating Supply Voltage: 12V; Evaluation Kit: Yes; Interface: I2C,SPI,USB; Core Architecture: AVR; Number of Bits: 8; Data Bus Width: 8b; Supplier 1: Farnell; Manufacturer: Arduino; RoHS: Yes; Category: Embedded Processors and Controllers; Stock 1: 251; Pricing 1: 1=21,19000 (EUR); Weight: 0.358383oz; Package Quantity: 50; Packaging: Bulk; Series: AVR® ATmega; Length: 7inch; Width: 5inch; Height: 0.25inch; Reach SVHC Compliant: Yes; ComponentLink1URL: https://datasheet.ciiva.com/2398/arduinonanomanual23-2398236.pdf?src-supplier=Digi-Key; ComponentLink1Description: https://datasheet.ciiva.com/2398/arduinonanomanual23-2398236.pdf?src-supplier=Digi-Key; ComponentLink2URL: https://datasheet.ciiva.com/19455/2121148-19455443.pdf?src-supplier=Jameco; ComponentLink2Description: https://datasheet.ciiva.com/19455/2121148-19455443.pdf?src-supplier=Jameco; ComponentLink3URL: https://datasheet.ciiva.com/1336/1682238-1336473.pdf?src-supplier=Element14; ComponentLink3Description: https://datasheet.ciiva.com/1336/1682238-1336473.pdf?src-supplier=Element14; ComponentLink4URL: https://datasheet.ciiva.com/1414/810078-1414124.pdf?src-supplier=Newark; ComponentLink4Description: https://datasheet.ciiva.com/1414/810078-1414124.pdf?src-supplier=Newark; ComponentLink5URL: https://datasheet.ciiva.com/4926/arduino-arduinoboardnano-188748-4926316.pdf?src-supplier=Mouser; ComponentLink5Description: https://datasheet.ciiva.com/4926/arduino-arduinoboardnano-188748-4926316.pdf?src-supplier=Mouser; Supplier Part Number 1: 1848691

## Sheet [08]-PowerSupply.SchDoc: Powersupplies
size A3; Organization: Toradex AG; Address1: Altsagenstrasse 5; Address2: Horw; Address3: 6048; Address4: Switzerland; DocumentNumber: 7; Revision: V3.2; SheetNumber: 7; SheetTotal: 13; PageSetup: Record=PageOptions|CenterHorizontal=True|CenterVertical=True|PrintScale=0.73|XCorrection=1.00|YCorrection=1.00|PrintKind=0|BorderSize=5000000|LeftOffset=0|BottomOffset=0|Orientation=2|PaperLength=1000|PaperWidth=1000|Scale=100|PaperSource=7|PrintQuality=-4|MediaType=1|DitherType=10|PaperKind=A4|PrintScaleMode=1
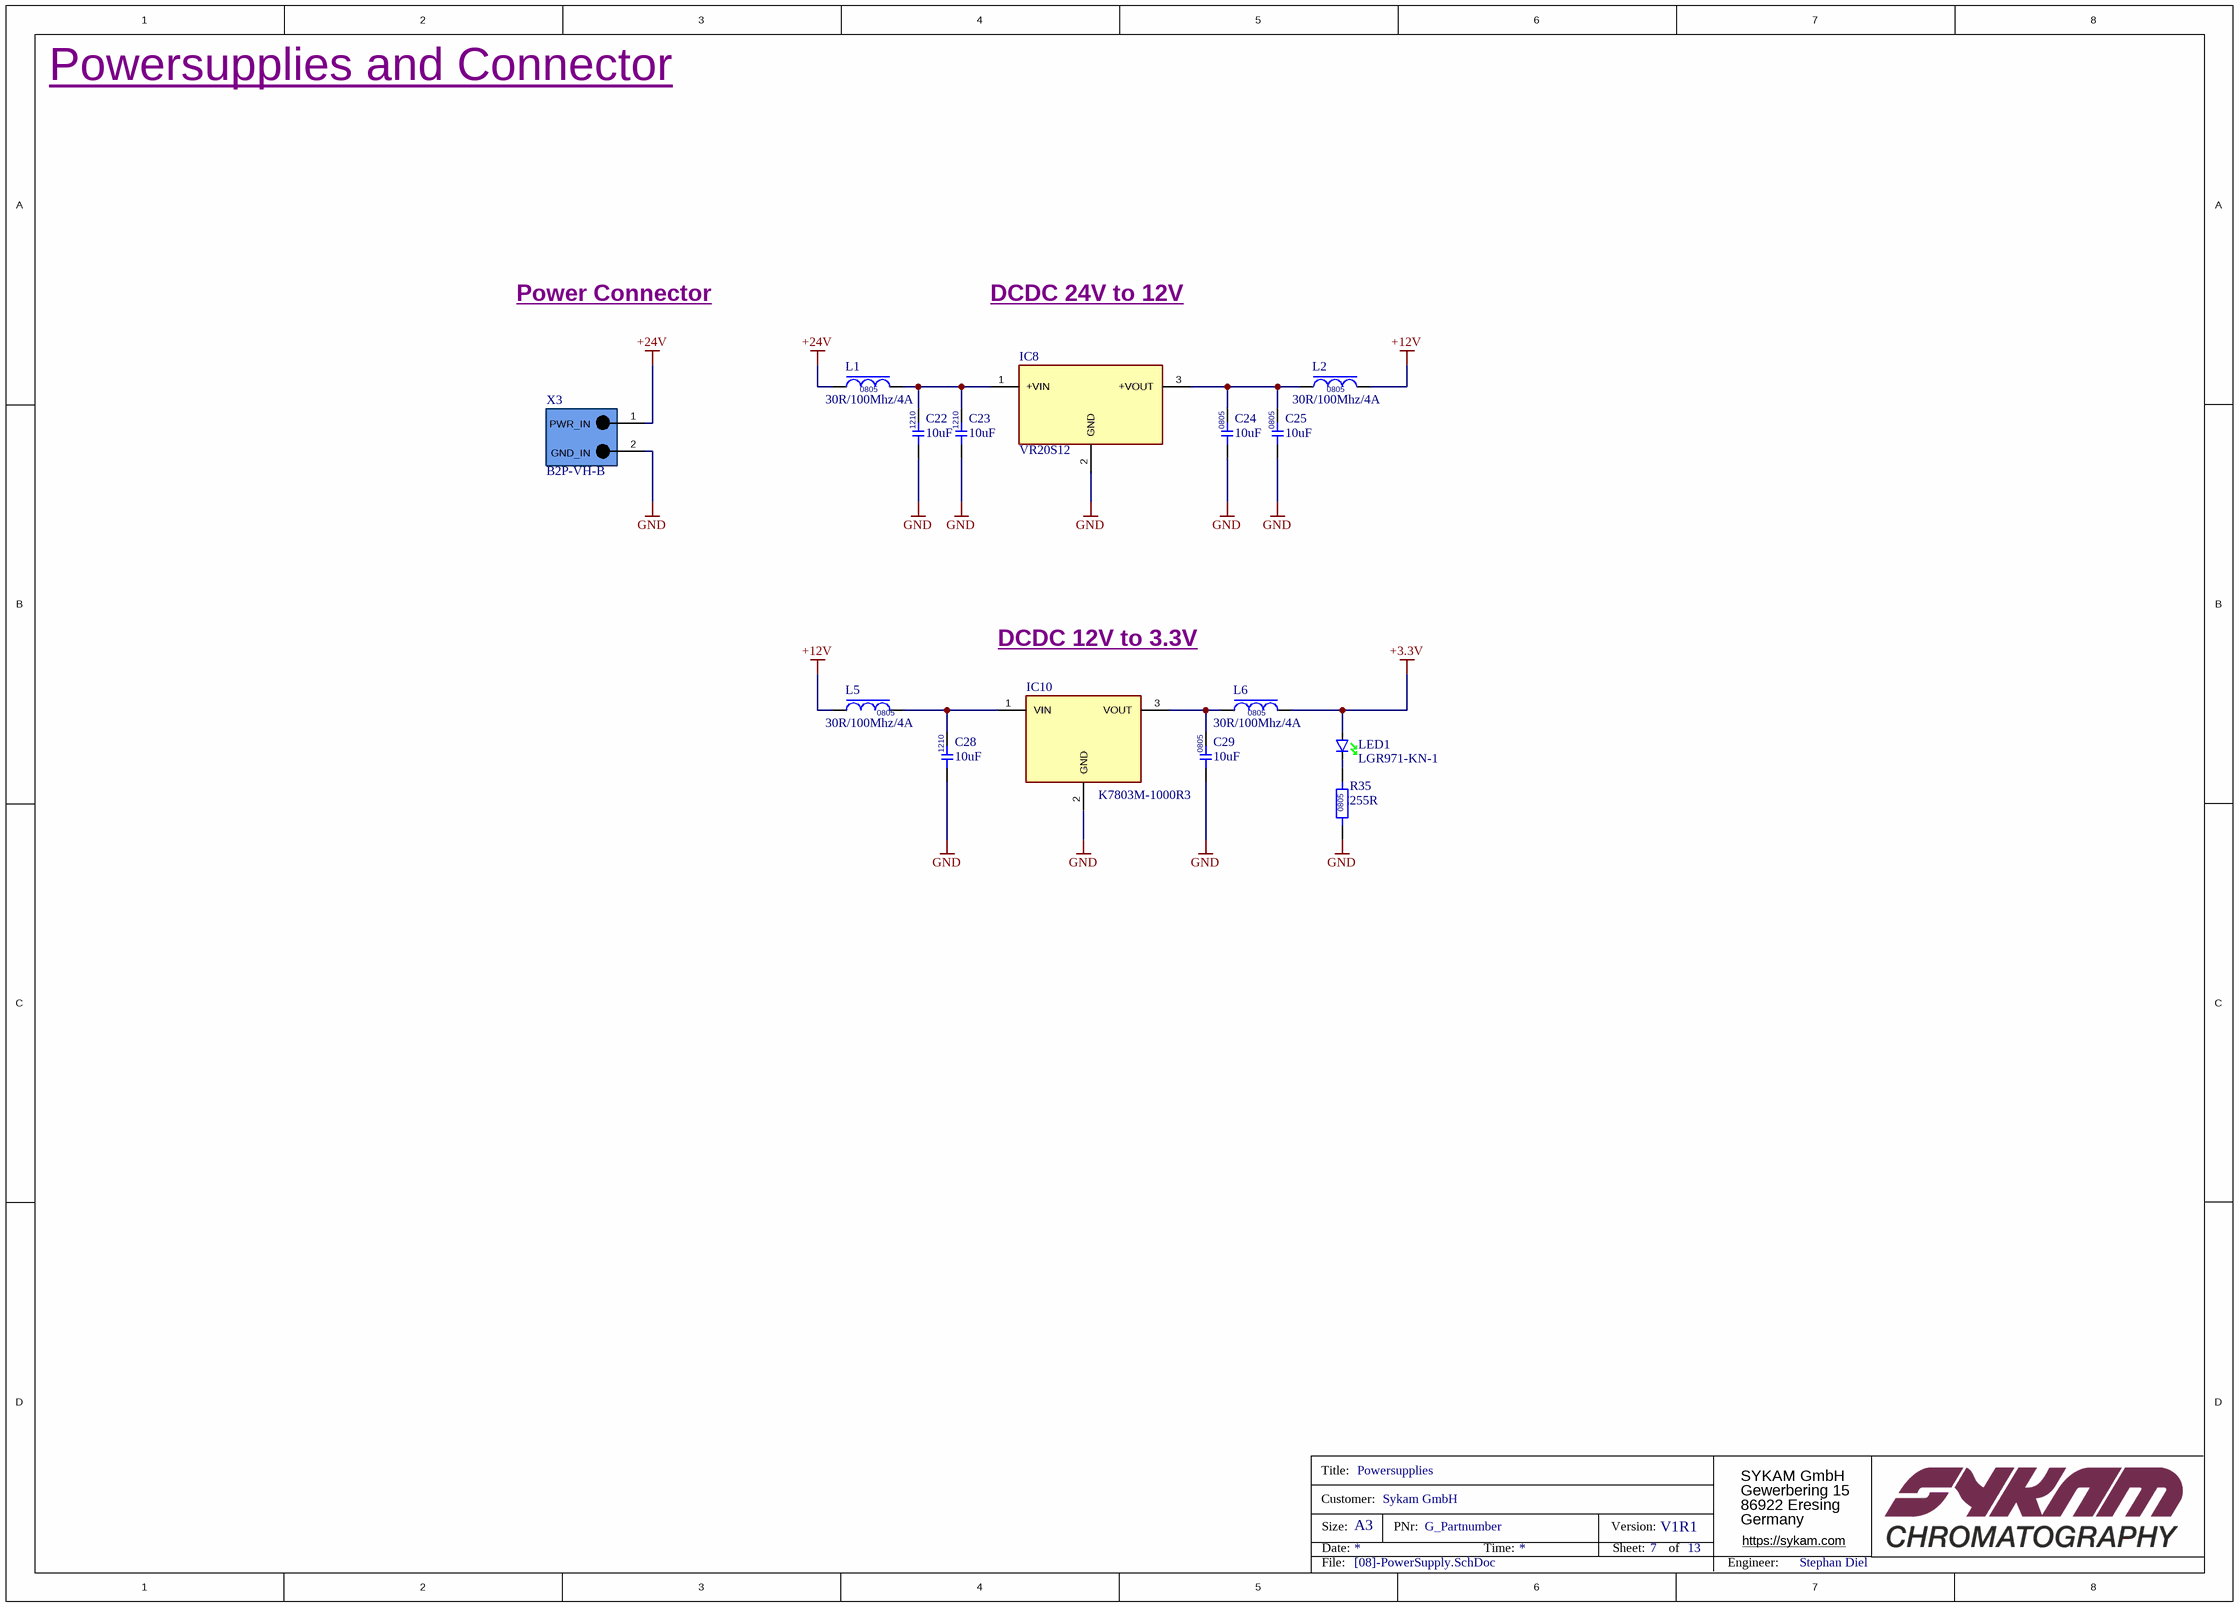
[diagram p7: [08]-PowerSupply.SchDoc]

### Parts
C22  10uF  [C1210]
C23  10uF  [C1210]
C24  10uF  [C0805]
C25  10uF  [C0805]
C28  10uF  [C1210]
C29  10uF  [C0805]
IC8  VR20S12  [IC_VR20S12_THT]
IC10  K7803M-1000R3  [IC_K7803M-1000R3_THT]
L1  30R/100Mhz/4A  [L0805]
L2  30R/100Mhz/4A  [L0805]
L5  30R/100Mhz/4A  [L0805]
L6  30R/100Mhz/4A  [L0805]
LED1  LGR971-KN-1  [LED0805]
R35  255R  [R0805]
X3  B2P-VH-B  [CON-B2P-VH-B-3.96MM_nn]

### Nets
+3.3V: L6.2 LED1.2A(A)
+12V: L2.2 L5.2
+24V: L1.1 X3.1(GND_IN)
GND: C22.1 C23.1 C24.1 C25.1 C28.1 C29.1 IC8.2(GND) IC10.2(GND) R35.1 X3.2(PWR_IN)
NetC22_2: C22.2 C23.2 IC8.1(+VIN) L1.2
NetC24_2: C24.2 C25.2 IC8.3(+VOUT) L2.1
NetC28_2: C28.2 IC10.1(VIN) L5.1
NetC29_2: C29.2 IC10.3(VOUT) L6.1
NetLED1_1K: LED1.1K(K) R35.2

### Notes on the sheet
- Powersupplies and Connector
- Power Connector
- DCDC 24V to 12V
- DCDC 12V to 3.3V
- Title:
- Customer:
- Size:
- Date:
- A3
- PNr:
- Time:
- Version:
- Sheet:
- of
- File:
- Engineer:
- Title
- Number:
- Revision:
- Sheet

### Library data of the parts
C22 C23 C28 = C_10uF_C1210C106K5RACTU: CAP CER 10UF 50V X7R 1210; Manufacturer: KEMET; Dielectric Material: Ceramic; Tolerance: 10%; Supplier 1: Digi-Key; Manufacturer Part Number: C1210C106K5RACTU; RoHS: Yes; Category: Ceramic Capacitors; Stock 1: 21988; Pricing 1: 1=0,90000, 10=0,66400, 100=0,45540, 500=0,36052 (USD); Mount: Surface Mount; Case/Package: 1210; Weight: 0.000564oz; Case Code (Metric): 3225; Case Code (Imperial): 1210; Min Operating Temperature: -55°C; Max Operating Temperature: 125°C; Packaging: Tape and Reel; Voltage Rating: 50V; Voltage: 50V; Dielectric: X7R; Termination: SMD/SMT; Voltage Rating (DC): 50V; Package Quantity: 1000; Capacitance: 10uF; Length: 3.2mm; Height: 2.5mm; Width: 2.5mm; Thickness: 0.11inch; Depth: 2.5mm; REACH SVHC: No SVHC; ComponentLink1URL: http://www.mouser.com/ds/2/212/KEM_C1002_X7R_SMD-357932.pdf?src-supplier=Mouser; ComponentLink1Description: http://www.mouser.com/ds/2/212/KEM_C1002_X7R_SMD-357932.pdf?src-supplier=Mouser; ComponentLink2URL: http://uk.rs-online.com/webdocs/1515/0900766b8151523b.pdf?src-supplier=RSComponents; ComponentLink2Description: http://uk.rs-online.com/webdocs/1515/0900766b8151523b.pdf?src-supplier=RSComponents; ComponentLink3URL: http://www.farnell.com/datasheets/2740742.pdf?src-supplier=Farnell; ComponentLink3Description: http://www.farnell.com/datasheets/2740742.pdf?src-supplier=Farnell; ComponentLink4URL: https://api.kemet.com/component-edge/download/datasheet/C1210C106K5RACTU.pdf?src-supplier=Digi-Key; ComponentLink4Description: https://api.kemet.com/component-edge/download/datasheet/C1210C106K5RACTU.pdf?src-supplier=Digi-Key; ComponentLink5URL: http://capacitoredge.kemet.com/capedge2/DataSheet/Datasheet-C0402C471J3GACTU.pdf?pn=C1210C106K5RACTU&src-supplier=Avnet; ComponentLink5Description: http://capacitoredge.kemet.com/capedge2/DataSheet/Datasheet-C0402C471J3GACTU.pdf?pn=C1210C106K5RACTU&src-supplier=Avnet; ComponentLink6URL: http://www.farnell.com/datasheets/2740742.pdf?src-supplier=Element14; ComponentLink6Description: http://www.farnell.com/datasheets/2740742.pdf?src-supplier=Element14; ComponentLink7URL: http://capacitoredge.kemet.com/capedge2/DataSheet/Datasheet-C1210C106K5RACTU.pdf?pn=C1210C106K5RACTU&src-supplier=Avnet; ComponentLink7Description: http://capacitoredge.kemet.com/capedge2/DataSheet/Datasheet-C1210C106K5RACTU.pdf?pn=C1210C106K5RACTU&src-supplier=Avnet; ComponentLink8URL: http://www.farnell.com/datasheets/1886292.pdf?src-supplier=Newark; ComponentLink8Description: http://www.farnell.com/datasheets/1886292.pdf?src-supplier=Newark; ComponentLink9URL: http://www.farnell.com/datasheets/2740742.pdf?src-supplier=Newark; ComponentLink9Description: http://www.farnell.com/datasheets/2740742.pdf?src-supplier=Newark; Supplier Part Number 1: 399-11629-1-ND
C24 C25 C29 = C_10uF_GRM21BR6YA106ME43L: 0805 10 uF 50 V ±20% Tolerance X5R Multilayer Ceramic Capacitor; Manufacturer: Murata; Voltage Rating: 35V; Supplier 1: Digi-Key; Manufacturer Part Number: GRM21BR6YA106ME43L; RoHS: Yes; Category: Ceramic Capacitors; Stock 1: 143980; Pricing 1: 1=0,48000, 10=0,33200, 100=0,19920, 500=0,14942, 1000=0,12617 (USD); Mount: Surface Mount; Case/Package: 0805; Weight: 0.000335oz; Case Code (Imperial): 0805; Case Code (Metric): 2012; Min Operating Temperature: -55°C; Max Operating Temperature: 85°C; Tolerance: 20%; Capacitance: 10uF; Packaging: Tape and Reel; Dielectric: X5R; Termination: SMD/SMT; Voltage Rating (DC): 35V; Package Quantity: 3000; Length: 0.079inch; Height: 1.25mm; Width: 0.049inch; Thickness: 0.057inch; ComponentLink1URL: http://www.mouser.com/ds/2/281/c02e-2905.pdf?src-supplier=Mouser; ComponentLink1Description: http://www.mouser.com/ds/2/281/c02e-2905.pdf?src-supplier=Mouser; ComponentLink2URL: http://search.murata.co.jp/Ceramy/image/img/A01X/G101/ENG/GRM21BR6YA106ME43-01.pdf?src-supplier=Digi-Key; ComponentLink2Description: http://search.murata.co.jp/Ceramy/image/img/A01X/G101/ENG/GRM21BR6YA106ME43-01.pdf?src-supplier=Digi-Key; Supplier Part Number 1: 490-10515-6-ND
IC8 = IC_VR20S12: DC-DC Converter, Switching Regulater, 2A, SIP, VR Series; Manufacturer: XP Power; Supplier 1: Farnell; Manufacturer Part Number: VR20S12; RoHS: No; Category: Board Mount Modules; Pricing 1: 1=6,07000, 5=5,88000, 10=5,70000, 20=5,46000, 50=5,10000 (EUR); Supplier Part Number 1: 3525433
IC10 = IC_K7803M-1000R3: Nichtisoliertes PoL-Modul DC/DC-Wandler 1 Ausgang 3,3V 1A 6V - 36V Eingang
L1 L2 L5 L6 = L_BLM21PG300SN1D: as L7 on sheet [07]-MCU; Supplier 1: Digi-Key; Manufacturer Part Number: BLM21PG300SN1D; RoHS: Yes; Category: Ferrite Beads and Chips; Case/Package: 0805; Number of Pins: 2; Core Material: Ferrite; Case Code (Metric): 2012; Case Code (Imperial): 0805; Min Operating Temperature: -55°C; Max Operating Temperature: 125°C; Frequency: 100MHz; Packaging: Tape and Reel; Package Quantity: 1; Max Current Rating: 4A; Number of Lines: 1; Termination: SMD/SMT; Test Frequency: 100MHz; DC Current: 3A; Military Standard: Not; Current Rating: 4A; Length: 2mm; Height: 0.85mm; Width: 1.25mm; Depth: 1.25mm; Radiation Hardening: No; Lead Free: Lead Free; REACH SVHC: No SVHC; ComponentLink1URL: https://datasheet.ciiva.com/11795/0900766b80021a8e-11795584.pdf?src-supplier=RSComponents; ComponentLink1Description: https://datasheet.ciiva.com/11795/0900766b80021a8e-11795584.pdf?src-supplier=RSComponents; ComponentLink2URL: https://datasheet.ciiva.com/19460/1845339-19460237.pdf?src-supplier=Jameco; ComponentLink2Description: https://datasheet.ciiva.com/19460/1845339-19460237.pdf?src-supplier=Jameco; ComponentLink3URL: https://datasheet.ciiva.com/25903/l0110s0100blm21p-25903510.pdf?src-supplier=Avnet+Europe; ComponentLink3Description: https://datasheet.ciiva.com/25903/l0110s0100blm21p-25903510.pdf?src-supplier=Avnet+Europe; ComponentLink4URL: https://datasheet.ciiva.com/3081/l0110s0100blm21p-3081657.pdf?src-supplier=Avnet; ComponentLink4Description: https://datasheet.ciiva.com/3081/l0110s0100blm21p-3081657.pdf?src-supplier=Avnet; ComponentLink5URL: https://datasheet.ciiva.com/16199/l0110s0100blm21p-16199625.pdf?src-supplier=Future+Electronics; ComponentLink5Description: https://datasheet.ciiva.com/16199/l0110s0100blm21p-16199625.pdf?src-supplier=Future+Electronics; ComponentLink6URL: https://datasheet.ciiva.com/3081/l0110s0100blm21p-3081658.pdf?src-supplier=Avnet; ComponentLink6Description: https://datasheet.ciiva.com/3081/l0110s0100blm21p-3081658.pdf?src-supplier=Avnet; ComponentLink7URL: https://datasheet.ciiva.com/6212/l0110s0100blm21p-6212358.pdf?src-supplier=Digi-Key; ComponentLink7Description: https://datasheet.ciiva.com/6212/l0110s0100blm21p-6212358.pdf?src-supplier=Digi-Key; ComponentLink8URL: https://datasheet.ciiva.com/6212/l0110s0100blm21p-6212360.pdf?src-supplier=Digi-Key; ComponentLink8Description: https://datasheet.ciiva.com/6212/l0110s0100blm21p-6212360.pdf?src-supplier=Digi-Key; ComponentLink9URL: https://datasheet.ciiva.com/8021/1756152-8021599.pdf?src-supplier=Element14; ComponentLink9Description: https://datasheet.ciiva.com/8021/1756152-8021599.pdf?src-supplier=Element14; ComponentLink10URL: https://datasheet.ciiva.com/41449/001172365-da-01-en-drossel-0805-30r0-2-0x1-25mm-4000st-41449606.pdf?src-supplier=Conrad; ComponentLink10Description: https://datasheet.ciiva.com/41449/001172365-da-01-en-drossel-0805-30r0-2-0x1-25mm-4000st-41449606.pdf?src-supplier=Conrad; Supplier Part Number 1: 490-1052-1-ND; Stock 1: 88452; IPC7352C: done; SCHChecked: Initials after checked
LED1 = LED_LGR971-KN-1: LED Uni-Color Green 572nm 2-Pin SMD T/R; Manufacturer: Osram Opto; Lens Color: White; Test Current: 20mA; Dominant Wavelength: 570nm; Lens Transparency: Diffused; Luminous Flux: 0.1lm; Number of Elements: 1; Power Dissipation: 65mW; Forward Current: 25mA; Forward Voltage: 2.2V; Lens Style: Diffused,Flat,Colorless,Rectangular; Luminous Intensity: 45mcd; Viewing Angle: 160°; Reverse Voltage: 12V; Lens Size: 1.25mm; Supplier 1: Digi-Key; Manufacturer Part Number: LGR971-KN-1; RoHS: Yes; Category: LEDs; Stock 1: 89127; Pricing 1: 1=0,26000, 10=0,19100, 100=0,09050, 500=0,06036, 1000=0,04728 (USD); Mount: Surface Mount; Case/Package: 0805; Number of Pins: 2; Case Code (Metric): 2012; Color: Green; Case Code (Imperial): 0805; Min Operating Temperature: -30°C; Max Operating Temperature: 85°C; Packaging: Tape and Reel; Package Quantity: 1; Illumination Color: Green; Number of LEDs: 1; Length: 2.1mm; Height: 0.9mm; Depth: 1.35mm; Width: 1.25mm; Radiation Hardening: No; ComponentLink1URL: https://datasheet.ciiva.com/15198/getdatasheetpartid-233880-15198360.pdf?src-supplier=Verical; ComponentLink1Description: https://datasheet.ciiva.com/15198/getdatasheetpartid-233880-15198360.pdf?src-supplier=Verical; ComponentLink2URL: https://datasheet.ciiva.com/15198/getdatasheetpartid-462214-15198395.pdf?src-supplier=Verical; ComponentLink2Description: https://datasheet.ciiva.com/15198/getdatasheetpartid-462214-15198395.pdf?src-supplier=Verical; ComponentLink3URL: https://datasheet.ciiva.com/4688/g-r971-221296-4688589.pdf?src-supplier=Mouser; ComponentLink3Description: https://datasheet.ciiva.com/4688/g-r971-221296-4688589.pdf?src-supplier=Mouser; ComponentLink4URL: https://datasheet.ciiva.com/14918/00078860-0-14918604.pdf?src-supplier=Digi-Key; ComponentLink4Description: https://datasheet.ciiva.com/14918/00078860-0-14918604.pdf?src-supplier=Digi-Key; ComponentLink5URL: https://datasheet.ciiva.com/14918/00078860-0-14918605.pdf?src-supplier=Digi-Key; ComponentLink5Description: https://datasheet.ciiva.com/14918/00078860-0-14918605.pdf?src-supplier=Digi-Key; ComponentLink6URL: https://datasheet.ciiva.com/14918/00078860-0-14918606.pdf?src-supplier=Digi-Key; ComponentLink6Description: https://datasheet.ciiva.com/14918/00078860-0-14918606.pdf?src-supplier=Digi-Key; Supplier Part Number 1: 475-1410-1-ND
R35 = R_255R_RC0805FR-07255RL: Res Thick Film 0805 255 Ohm 1% 0.125W(1/8W) ±100ppm/C Epoxy SMD T/R; Manufacturer: Yageo; Power Rating: 125mW; Voltage Rating: 150V; Temperature Coefficient: 100ppm/°C; Manufacturer Part Number: RC0805FR-07255RL; RoHS: Yes; Category: Chip SMD Resistors; Stock 1: 5010; Pricing 1: 1=0,10000, 10=0,04000, 100=0,01630, 1000=0,00731, 2500=0,00635 (USD); Case/Package: 0805; Case Code (Metric): 2012; Case Code (Imperial): 0805; Contact Plating: Tin,Matte; Min Operating Temperature: -55°C; Max Operating Temperature: 155°C; Package Quantity: 1; Resistance: 255R; Tolerance: 1%; Packaging: Tape and Reel; Composition: Thick Film; Termination: SMD/SMT; Voltage Rating (DC): 150V; Number of Terminations: 2; Military Standard: Not; Max Power Dissipation: 125mW; Features: Moisture Resistant; Length: 2mm; Height: 0.024inch; Width: 0.049inch; Depth: 1.25mm; Radiation Hardening: No; Lead Free: Lead Free; ComponentLink1URL: https://datasheet.ciiva.com/2457/pyu-r-int-thick-7-2457200.pdf?src-supplier=Digi-Key; ComponentLink1Description: https://datasheet.ciiva.com/2457/pyu-r-int-thick-7-2457200.pdf?src-supplier=Digi-Key; ComponentLink2URL: https://datasheet.ciiva.com/2457/pyu-r-int-thick-7-2457201.pdf?src-supplier=Digi-Key; ComponentLink2Description: https://datasheet.ciiva.com/2457/pyu-r-int-thick-7-2457201.pdf?src-supplier=Digi-Key; ComponentLink3URL: https://datasheet.ciiva.com/2457/pyu-r-int-thick-7-2457202.pdf?src-supplier=Digi-Key; ComponentLink3Description: https://datasheet.ciiva.com/2457/pyu-r-int-thick-7-2457202.pdf?src-supplier=Digi-Key; Supplier 1: Digi-Key; Supplier Part Number 1: 541-255CCT-ND
X3 = CON_2p_B2P-VH-B(LF)(SN): CONN HEADER TOP 2POS 3.96MM VH; Manufacturer: JST; Number of Positions: 2; Connector Type: Male Pin; Pitch: 0.156inch; PCBChecked: initials after Checked; Supplier 1: RSComponents; Manufacturer Part Number: B2P-VH-B(LF)(SN); RoHS: Yes; Category: Connectors; Mount: Through Hole; Color: Natural; Contact Plating: Tin; Termination: Solder; Number of Rows: 1; Fastening Type: Friction,Ramp; Packaging: Bulk; Contact Mating Length: 0.303inch; Lead Free: Lead Free; ComponentLink1URL: https://datasheet.ciiva.com/6853/evh-6853485.pdf?src-supplier=Digi-Key; ComponentLink1Description: https://datasheet.ciiva.com/6853/evh-6853485.pdf?src-supplier=Digi-Key; ComponentLink2URL: https://datasheet.ciiva.com/16358/b2p-vh-blfsn-16358717.pdf?src-supplier=Future+Electronics; ComponentLink2Description: https://datasheet.ciiva.com/16358/b2p-vh-blfsn-16358717.pdf?src-supplier=Future+Electronics; Supplier Part Number 1: 7495193; Pricing 1: 50=0,19300, 500=0,16400, 1250=0,15500, 2500=0,14500, 5000=0,13500 (EUR); IPC7352C: initials after Checked; SCHChecked: initials after Checked

## Sheet [09]-Digital-IO.SchDoc: I²C Digital-IO
size A3; Organization: Toradex AG; Address1: Altsagenstrasse 5; Address2: Horw; Address3: 6048; Address4: Switzerland; DocumentNumber: 8; Revision: V3.2; SheetNumber: 8; SheetTotal: 13; PageSetup: Record=PageOptions|CenterHorizontal=True|CenterVertical=True|PrintScale=0.73|XCorrection=1.00|YCorrection=1.00|PrintKind=0|BorderSize=5000000|LeftOffset=0|BottomOffset=0|Orientation=2|PaperLength=1000|PaperWidth=1000|Scale=100|PaperSource=7|PrintQuality=-4|MediaType=1|DitherType=10|PaperKind=A4|PrintScaleMode=1
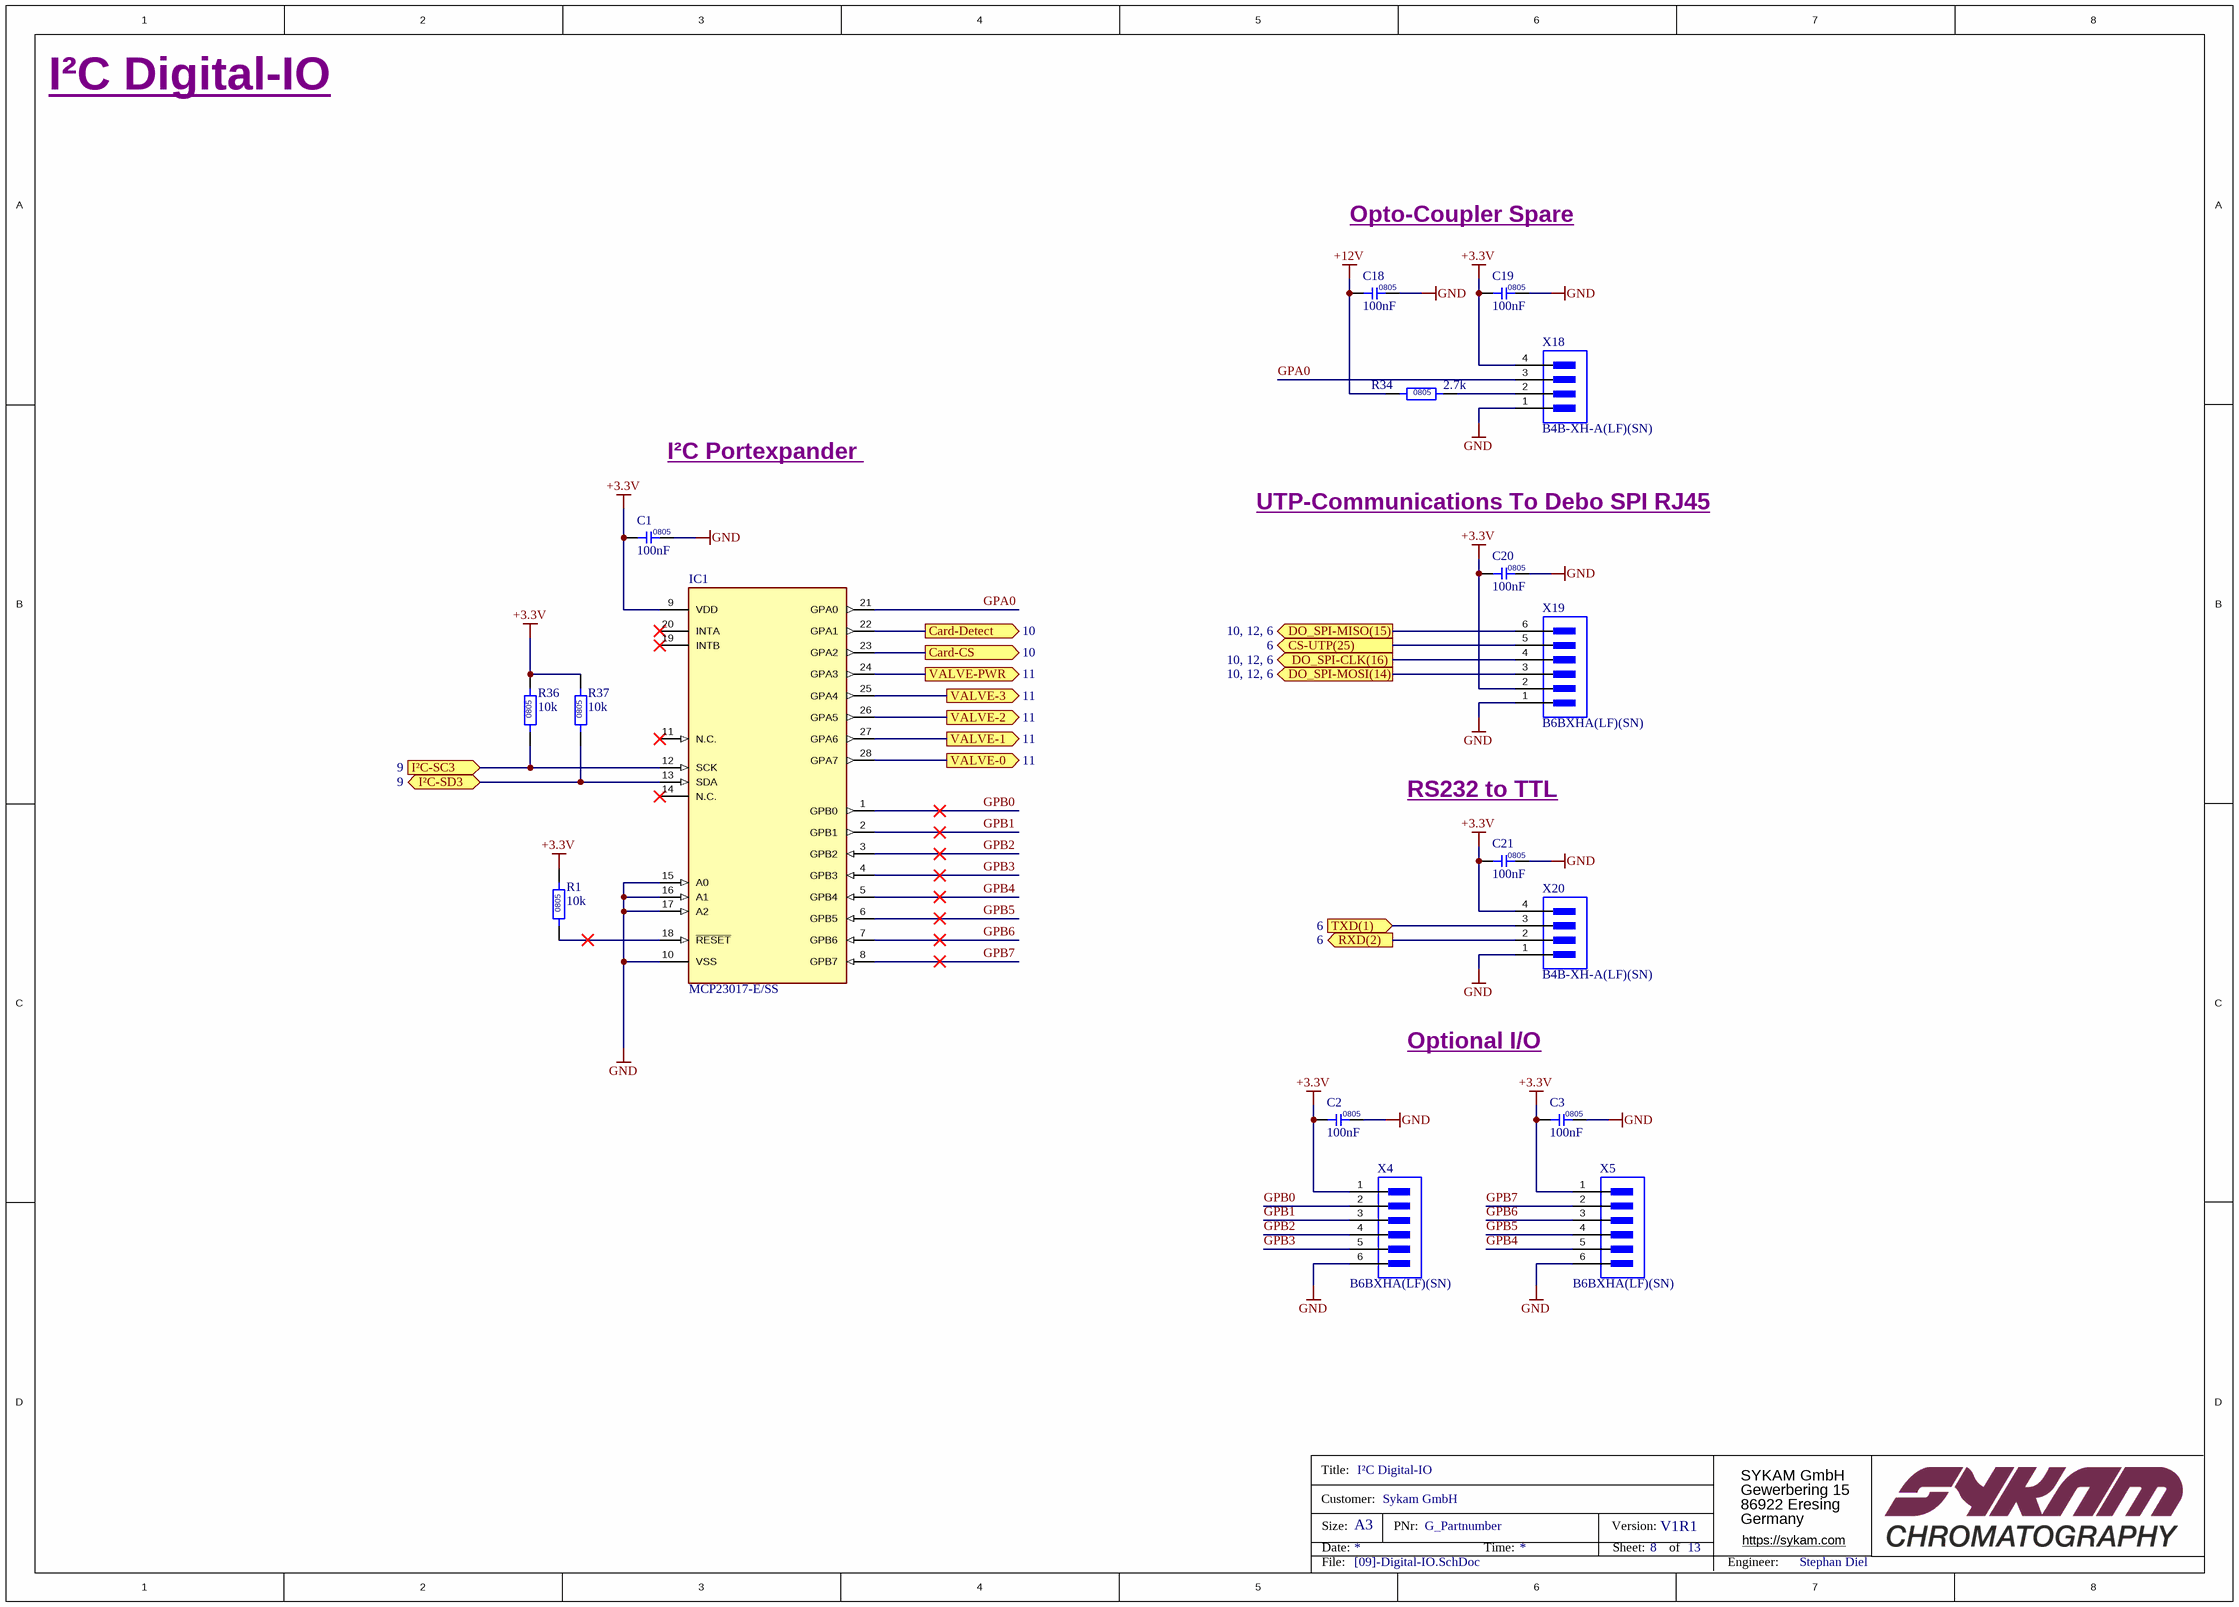
[diagram p8: [09]-Digital-IO.SchDoc]

### Parts
C1  100nF  [C0805]
C2  100nF  [C0805]
C3  100nF  [C0805]
C18  100nF  [C0805]
C19  100nF  [C0805]
C20  100nF  [C0805]
C21  100nF  [C0805]
IC1  MCP23017-E/SS  [IC_MCP23017-E/SS_SSOP28]
R1  10k  [R0805]
R34  2.7k  [R0805]
R36  10k  [R0805]
R37  10k  [R0805]
X4  B6BXHA(LF)(SN)  [B6BXHA(LF)(SN)]
X5  B6BXHA(LF)(SN)  [B6BXHA(LF)(SN)]
X18  B4B-XH-A(LF)(SN)  [CON_B4B-XH-A(LF)(SN)]
X19  B6BXHA(LF)(SN)  [B6BXHA(LF)(SN)]
X20  B4B-XH-A(LF)(SN)  [CON_B4B-XH-A(LF)(SN)]

### Ports
Card-CS (out, see 10), Card-Detect (out, see 10), CS-UTP(25) (out, see 6), DO_SPI-CLK(16) (out, see 10, 12, 6), DO_SPI-MISO(15) (out, see 10, 12, 6), DO_SPI-MOSI(14) (out, see 10, 12, 6), I²C-SC3 (in, see 9), I²C-SD3 (bidir, see 9), RXD(2) (out, see 6), TXD(1) (in, see 6), VALVE-0 (out, see 11), VALVE-1 (out, see 11), VALVE-2 (out, see 11), VALVE-3 (out, see 11), VALVE-PWR (out, see 11)

### Nets
+3.3V: C1.1 C2.1 C3.1 C19.1 C20.1 C21.1 IC1.9(VDD) R1.2 R36.2 R37.2 X4.1 X5.1 X18.4 X19.2 X20.4
+12V: C18.1 R34.1
GND: C1.2 C2.2 C3.2 C18.2 C19.2 C20.2 C21.2 IC1.10(VSS) IC1.15(A0) IC1.16(A1) IC1.17(A2) X4.6 X5.6 X18.1 X19.1 X20.1
CLK: X19.4 ; port DO_SPI-CLK(16)
GPA0: IC1.21(GPA0) X18.3
GPB0: IC1.1(GPB0) X4.2
GPB1: IC1.2(GPB1) X4.3
GPB2: IC1.3(GPB2) X4.4
GPB3: IC1.4(GPB3) X4.5
GPB4: IC1.5(GPB4) X5.5
GPB5: IC1.6(GPB5) X5.4
GPB6: IC1.7(GPB6) X5.3
GPB7: IC1.8(GPB7) X5.2
MISO: X19.6 ; port DO_SPI-MISO(15)
MOSI: X19.3 ; port DO_SPI-MOSI(14)
SC3: IC1.12(SCK) R36.1 ; port I²C-SC3
SD3: IC1.13(SDA) R37.1 ; port I²C-SD3
NetIC1_18: IC1.18(~{RESET}) R1.1
NetIC1_22: IC1.22(GPA1) ; port Card-Detect
NetIC1_23: IC1.23(GPA2) ; port Card-CS
NetIC1_24: IC1.24(GPA3) ; port VALVE-PWR
NetIC1_25: IC1.25(GPA4) ; port VALVE-3
NetIC1_26: IC1.26(GPA5) ; port VALVE-2
NetIC1_27: IC1.27(GPA6) ; port VALVE-1
NetIC1_28: IC1.28(GPA7) ; port VALVE-0
NetR34_2: R34.2 X18.2
NetX1_1: X20.3 ; port TXD(1)
NetX1_2: X20.2 ; port RXD(2)
NetX1_25: X19.5 ; port CS-UTP(25)

Not connected (* = marked no-connect by the designer): IC1 11(N.C.)* 14(N.C.)* 19(INTB)* 20(INTA)*

### Notes on the sheet
- Opto-Coupler Spare
- I²C Portexpander
- UTP-Communications To Debo SPI RJ45
- RS232 to TTL
- Optional I/O
- Title:
- Customer:
- Size:
- Date:
- A3
- PNr:
- Time:
- Version:
- Sheet:
- of
- File:
- Engineer:
- Title
- Number:
- Revision:
- Sheet

### Library data of the parts
C1-C3 C18-C21 = C_100nF_CC0805KRX7R9BB104: as C16 on sheet [07]-MCU; Supplier 1: Digi-Key; Manufacturer Part Number: CC0805KRX7R9BB104; RoHS: Yes; Category: Ceramic Capacitors; Mount: Surface Mount; Case/Package: 0805; Number of Pins: 2; Case Code (Metric): 2012; Case Code (Imperial): 0805; Min Operating Temperature: -55°C; Max Operating Temperature: 125°C; Packaging: Tape and Reel; Capacitance: 100nF; Voltage Rating: 50V; Package Quantity: 1; Dielectric: X7R; Termination: SMD/SMT; Voltage: 50V; Length: 2mm; Height: 0.85mm; Width: 0.049inch; Thickness: 0.033inch; Depth: 1.25mm; Radiation Hardening: No; REACH SVHC: No SVHC; Lead Free: Lead Free; Halogen Free: Halogen Free; ComponentLink1URL: https://datasheet.ciiva.com/11786/0900766b80d84f1d-11786009.pdf?src-supplier=RSComponents; ComponentLink1Description: https://datasheet.ciiva.com/11786/0900766b80d84f1d-11786009.pdf?src-supplier=RSComponents; ComponentLink2URL: https://datasheet.ciiva.com/11464/upy-gphc-x7r-6-3v-to-50v-8-11464757.pdf?src-supplier=Avnet; ComponentLink2Description: https://datasheet.ciiva.com/11464/upy-gphc-x7r-6-3v-to-50v-8-11464757.pdf?src-supplier=Avnet; ComponentLink3URL: https://datasheet.ciiva.com/28450/1489800-28450805.pdf?src-supplier=Element14; ComponentLink3Description: https://datasheet.ciiva.com/28450/1489800-28450805.pdf?src-supplier=Element14; ComponentLink4URL: https://datasheet.ciiva.com/155/mlccorderingcode-155929.pdf?src-supplier=Digi-Key; ComponentLink4Description: https://datasheet.ciiva.com/155/mlccorderingcode-155929.pdf?src-supplier=Digi-Key; ComponentLink5URL: https://datasheet.ciiva.com/155/mlccorderingcode-155930.pdf?src-supplier=Digi-Key; ComponentLink5Description: https://datasheet.ciiva.com/155/mlccorderingcode-155930.pdf?src-supplier=Digi-Key; ComponentLink6URL: https://datasheet.ciiva.com/155/mlccorderingcode-155931.pdf?src-supplier=Digi-Key; ComponentLink6Description: https://datasheet.ciiva.com/155/mlccorderingcode-155931.pdf?src-supplier=Digi-Key; ComponentLink7URL: https://datasheet.ciiva.com/46393/1734573-46393307.pdf?src-supplier=Element14; ComponentLink7Description: https://datasheet.ciiva.com/46393/1734573-46393307.pdf?src-supplier=Element14; ComponentLink8URL: https://datasheet.ciiva.com/16625/upy-gphc-x7r-6-3v-to-50v-8-16625549.pdf?src-supplier=Avnet+Europe; ComponentLink8Description: https://datasheet.ciiva.com/16625/upy-gphc-x7r-6-3v-to-50v-8-16625549.pdf?src-supplier=Avnet+Europe; ComponentLink9URL: https://datasheet.ciiva.com/29242/445210-da-01-en-kerko-chip-0805-x7r-0-1uf-10proz-50vg-29242074.pdf?src-supplier=Conrad; ComponentLink9Description: https://datasheet.ciiva.com/29242/445210-da-01-en-kerko-chip-0805-x7r-0-1uf-10proz-50vg-29242074.pdf?src-supplier=Conrad; Supplier Part Number 1: 311-1140-6-ND; Stock 1: 7118979; IPC7352C: done; SCHChecked: Initials after checked
IC1 = IC_MCP23017-E/SS: I²C Bus IC Operating temperature: -40...+125 °C Power supply: 1.8...5.5 V Package: SSOP-20; Manufacturer: Microchip; Interface: I2C,Serial; Min Supply Voltage: 4.5V; Max Supply Voltage: 5.5V; Number of Channels: 1; Nominal Supply Current: 1mA; Output Current: 25mA; Max Power Dissipation: 700mW; Number of I/Os: 16; Max Frequency: 1.7MHz; Output Type: PUSH-PULL; Supplier 1: Farnell; Manufacturer Part Number: MCP23017-E/SS; RoHS: Yes; Category: Interface ICs; Stock 1: 15856; Pricing 1: 1=2,13000, 25=1,60000, 100=1,57000 (EUR); Mount: Surface Mount; Case/Package: SSOP; Number of Pins: 28; Weight: 0.080001oz; Min Operating Temperature: -40°C; Max Operating Temperature: 125°C; Series: -; Packaging: Rail/Tube; Frequency: 1.7MHz; Number of Bits: 16; Supply Voltage-Nom: 5.5V; Supply Current: 1mA; Reach SVHC Compliant: Yes; Lead Free: Lead Free; RoHS Compliant: Yes; ComponentLink1URL: https://datasheet.ciiva.com/1495/12179-1495878.pdf?src-supplier=Element14; ComponentLink1Description: https://datasheet.ciiva.com/1495/12179-1495878.pdf?src-supplier=Element14; ComponentLink2URL: https://datasheet.ciiva.com/3149/21952b-3149160.pdf?src-supplier=Avnet; ComponentLink2Description: https://datasheet.ciiva.com/3149/21952b-3149160.pdf?src-supplier=Avnet; ComponentLink3URL: https://datasheet.ciiva.com/1780/21952b-1780093.pdf?src-supplier=Digi-Key; ComponentLink3Description: https://datasheet.ciiva.com/1780/21952b-1780093.pdf?src-supplier=Digi-Key; ComponentLink4URL: https://datasheet.ciiva.com/16454/filehandler-aspxddocname-en023709-16454261.pdf?src-supplier=Future+Electronics; ComponentLink4Description: https://datasheet.ciiva.com/16454/filehandler-aspxddocname-en023709-16454261.pdf?src-supplier=Future+Electronics; Supplier Part Number 1: 1467674
R1 R36 R37 = R_10k_RC0805FR-0710KL: RES SMD 10K OHM 1% 1/8W 0805; Manufacturer: Yageo; Temperature Coefficient: 100ppm/°C; Resistance: 10kR; Power Rating: 125mW; Voltage Rating: 150V; PCBChecked: initials after Checked; Supplier 1: Digi-Key; Manufacturer Part Number: RC0805FR-0710KL; RoHS: Yes; Category: Chip SMD Resistors; Case/Package: 0805; Case Code (Imperial): 0805; Case Code (Metric): 2012; Min Operating Temperature: -55°C; Max Operating Temperature: 155°C; Packaging: Tape and Reel; Tolerance: 1%; Composition: Thick Film; Features: Moisture Resistant; Termination: SMD/SMT; Number of Terminations: 2; Military Standard: Not; Max Power Dissipation: 125mW; Package Quantity: 1; Length: 2mm; Height: 0.024inch; Width: 0.049inch; Depth: 1.25mm; Lead Free: Lead Free; REACH SVHC: Unknown; ComponentLink1URL: https://datasheet.ciiva.com/11808/0900766b8106beab-11808151.pdf?src-supplier=RSComponents; ComponentLink1Description: https://datasheet.ciiva.com/11808/0900766b8106beab-11808151.pdf?src-supplier=RSComponents; ComponentLink2URL: https://datasheet.ciiva.com/12669/rc0805-12669688.pdf?src-supplier=Mouser; ComponentLink2Description: https://datasheet.ciiva.com/12669/rc0805-12669688.pdf?src-supplier=Mouser; ComponentLink3URL: https://datasheet.ciiva.com/2456/pyu-r-int-thick-7-2456973.pdf?src-supplier=Digi-Key; ComponentLink3Description: https://datasheet.ciiva.com/2456/pyu-r-int-thick-7-2456973.pdf?src-supplier=Digi-Key; ComponentLink4URL: https://datasheet.ciiva.com/16747/rc0805-16747087.pdf?src-supplier=Future+Electronics; ComponentLink4Description: https://datasheet.ciiva.com/16747/rc0805-16747087.pdf?src-supplier=Future+Electronics; ComponentLink5URL: https://datasheet.ciiva.com/46447/444164-46447563.pdf?src-supplier=Element14; ComponentLink5Description: https://datasheet.ciiva.com/46447/444164-46447563.pdf?src-supplier=Element14; ComponentLink6URL: https://datasheet.ciiva.com/2456/pyu-r-int-thick-7-2456972.pdf?src-supplier=Digi-Key; ComponentLink6Description: https://datasheet.ciiva.com/2456/pyu-r-int-thick-7-2456972.pdf?src-supplier=Digi-Key; ComponentLink7URL: https://datasheet.ciiva.com/2456/pyu-r-int-thick-7-2456974.pdf?src-supplier=Digi-Key; ComponentLink7Description: https://datasheet.ciiva.com/2456/pyu-r-int-thick-7-2456974.pdf?src-supplier=Digi-Key; Supplier Part Number 1: 311-10.0KCRCT-ND; Stock 1: 31284302; IPC7352C: done; SCHChecked: Initials after checked
R34 = R_2.7k_RT0805FRE072K7L: YAGEO (PHYCOMP)   RT0805FRE072K7L   Surface Mount Chip Resistor, Thin Film, RT Series, 2.7 kohm, 125 mW,  1%, 150 V; Resistance: 2.7kR; Temperature Coefficient: 50ppm/°C; Power Rating: 125mW; Voltage Rating: 150V; Supplier 1: Farnell; Manufacturer: Yageo; Manufacturer Part Number: RT0805FRE072K7L; RoHS: Yes; Category: Chip SMD Resistors; Stock 1: 4023; Pricing 1: 10=0,11500, 100=0,03970, 500=0,03190, 1000=0,02410 (EUR); Case/Package: 0805; Contact Plating: Tin,Matte; Case Code (Metric): 2012; Case Code (Imperial): 0805; Min Operating Temperature: -55°C; Max Operating Temperature: 125°C; Tolerance: 1%; Resistor Type: Thin Film; Package Quantity: 5000; Packaging: Tape and Reel; Number of Terminations: 2; Max Power Dissipation: 125mW; Voltage Rating (DC): 150V; Series: RT; Resistance Tolerance: 1%; Construction: Rectangular; Length: 0.079inch; Width: 0.049inch; Height: 0.024inch; Depth: 1.25mm; Radiation Hardening: No; REACH SVHC: Unknown; Military Standard: Not; Lead Free: Lead Free; RoHS Compliant: Yes; ComponentLink1URL: https://datasheet.ciiva.com/2561/pyu-rt-1-to-0-05-rohs-l-5-2561137.pdf?src-supplier=Digi-Key; ComponentLink1Description: https://datasheet.ciiva.com/2561/pyu-rt-1-to-0-05-rohs-l-5-2561137.pdf?src-supplier=Digi-Key; ComponentLink2URL: https://datasheet.ciiva.com/7942/1392914-7942127.pdf?src-supplier=Element14; ComponentLink2Description: https://datasheet.ciiva.com/7942/1392914-7942127.pdf?src-supplier=Element14; Supplier Part Number 1: 1500699
X4 X5 X19 = CON_6pol_B6BXHA(LF)(SN): CONN HEADER VERT 6POS 2.5MM; Manufacturer: JST; Current Rating: 3A; Number of Positions: 6; Contact Resistance: 20mR; Max Voltage Rating (AC): 250V; Connector Type: Male Pin; Insulation Resistance: 1GR; Wire/Cable Gauge: 22AWG; Supplier 1: Digi-Key; Manufacturer Part Number: B6BXHA(LF)(SN); RoHS: Yes; Category: FFC / FPC; Mount: Through Hole; Contact Plating: Tin,Lead,Copper; Contact Material: Brass; Color: Natural; Housing Color: White; Housing Material: Polyamide; Min Operating Temperature: -25°C; Max Operating Temperature: 85°C; Termination: Press-Fit; Number of Rows: 1; Max Current Rating: 3A; Packaging: Bulk; Orientation: Straight; Voltage Rating (AC): 250V; Voltage Rating: 250V; Number of Contacts: 6; Max Voltage Rating (DC): 250V; Package Quantity: 500; Length: 17.4mm; Pitch: 2.5mm; Depth: 5.75mm; Lead Pitch: 2.5mm; Lead Free: Lead Free; REACH SVHC: No SVHC; ComponentLink1URL: https://datasheet.ciiva.com/26894/getdatasheetpartid-424647-26894806.pdf?src-supplier=Verical; ComponentLink1Description: https://datasheet.ciiva.com/26894/getdatasheetpartid-424647-26894806.pdf?src-supplier=Verical; ComponentLink2URL: https://datasheet.ciiva.com/26894/getdatasheetpartid-641012-26894489.pdf?src-supplier=Verical; ComponentLink2Description: https://datasheet.ciiva.com/26894/getdatasheetpartid-641012-26894489.pdf?src-supplier=Verical; ComponentLink3URL: https://datasheet.ciiva.com/20207/523653-20207177.pdf?src-supplier=Rapid+Electronics; ComponentLink3Description: https://datasheet.ciiva.com/20207/523653-20207177.pdf?src-supplier=Rapid+Electronics; ComponentLink4URL: https://datasheet.ciiva.com/16397/b6b-xh-alfsn-16397116.pdf?src-supplier=Future+Electronics; ComponentLink4Description: https://datasheet.ciiva.com/16397/b6b-xh-alfsn-16397116.pdf?src-supplier=Future+Electronics; ComponentLink5URL: https://datasheet.ciiva.com/712/exh-712511.pdf?src-supplier=Digi-Key; ComponentLink5Description: https://datasheet.ciiva.com/712/exh-712511.pdf?src-supplier=Digi-Key; Supplier Part Number 1: 455-2271-ND
X18 X20 = CON_4pol_B4B-XH-A(LF)(SN): JST (JAPAN SOLDERLESS TERMINALS) - B4B-XH-A (LF)(SN) - Wire-To-Board-Steckverbinder, vertikal, 2.5 mm, 4 Kontakt(e), Stiftleiste, Baureihe XH; Connector Type: Male Pin; Number of Positions: 4; Gender: Male; Contact Resistance: 20mR; Current Rating: 3A; Max Voltage Rating (AC): 250V; Insulation Resistance: 1GR; Pitch: 2.5mm; Wire/Cable Gauge: 22AWG; Supplier 1: Newark; Manufacturer: JST; Manufacturer Part Number: B4B-XH-A(LF)(SN); RoHS: Yes; Category: FFC / FPC; Mount: Through Hole; Contact Plating: Tin,Copper,Lead; Contact Material: Brass; Color: Natural; Housing Material: Polyamide; Housing Color: White; Material: Polyamide; Min Operating Temperature: -25°C; Max Operating Temperature: 85°C; Number of Rows: 1; Packaging: Bulk; Termination: Press-Fit; Max Current Rating: 3A; Package Quantity: 500; Orientation: Straight; Voltage Rating (AC): 250V; Voltage Rating: 250V; Max Voltage Rating (DC): 250V; Number of Contacts: 4; Length: 12.4mm; Depth: 5.75mm; Lead Pitch: 2.5mm; Lead Free: Lead Free; REACH SVHC: No SVHC; ComponentLink1URL: https://datasheet.ciiva.com/26894/getdatasheetpartid-455616-26894787.pdf?src-supplier=Verical; ComponentLink1Description: https://datasheet.ciiva.com/26894/getdatasheetpartid-455616-26894787.pdf?src-supplier=Verical; ComponentLink2URL: https://datasheet.ciiva.com/26924/getdatasheetpartid-640571-26924035.pdf?src-supplier=Verical; ComponentLink2Description: https://datasheet.ciiva.com/26924/getdatasheetpartid-640571-26924035.pdf?src-supplier=Verical; ComponentLink3URL: https://datasheet.ciiva.com/16203/b4b-xh-alfsn-16203642.pdf?src-supplier=Future+Electronics; ComponentLink3Description: https://datasheet.ciiva.com/16203/b4b-xh-alfsn-16203642.pdf?src-supplier=Future+Electronics; ComponentLink4URL: https://datasheet.ciiva.com/726/exh-726404.pdf?src-supplier=Digi-Key; ComponentLink4Description: https://datasheet.ciiva.com/726/exh-726404.pdf?src-supplier=Digi-Key; Supplier Part Number 1: 73M9436